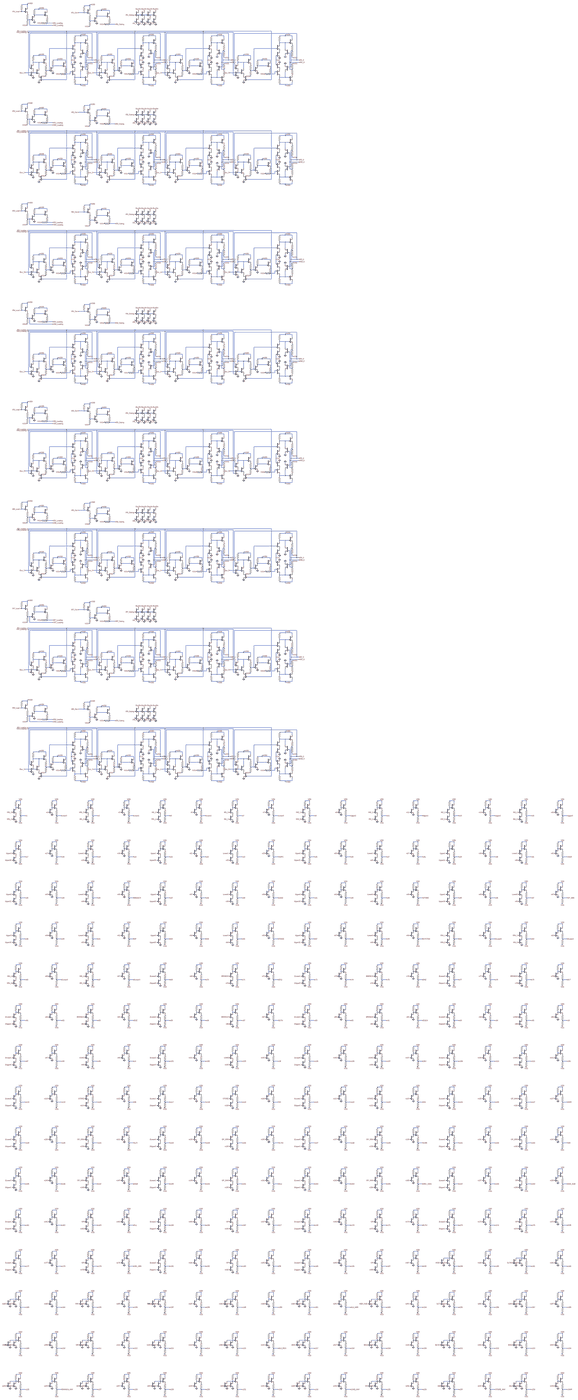
[diagram p0: schematic rv32i_instruction_register.asc, whole sheet]
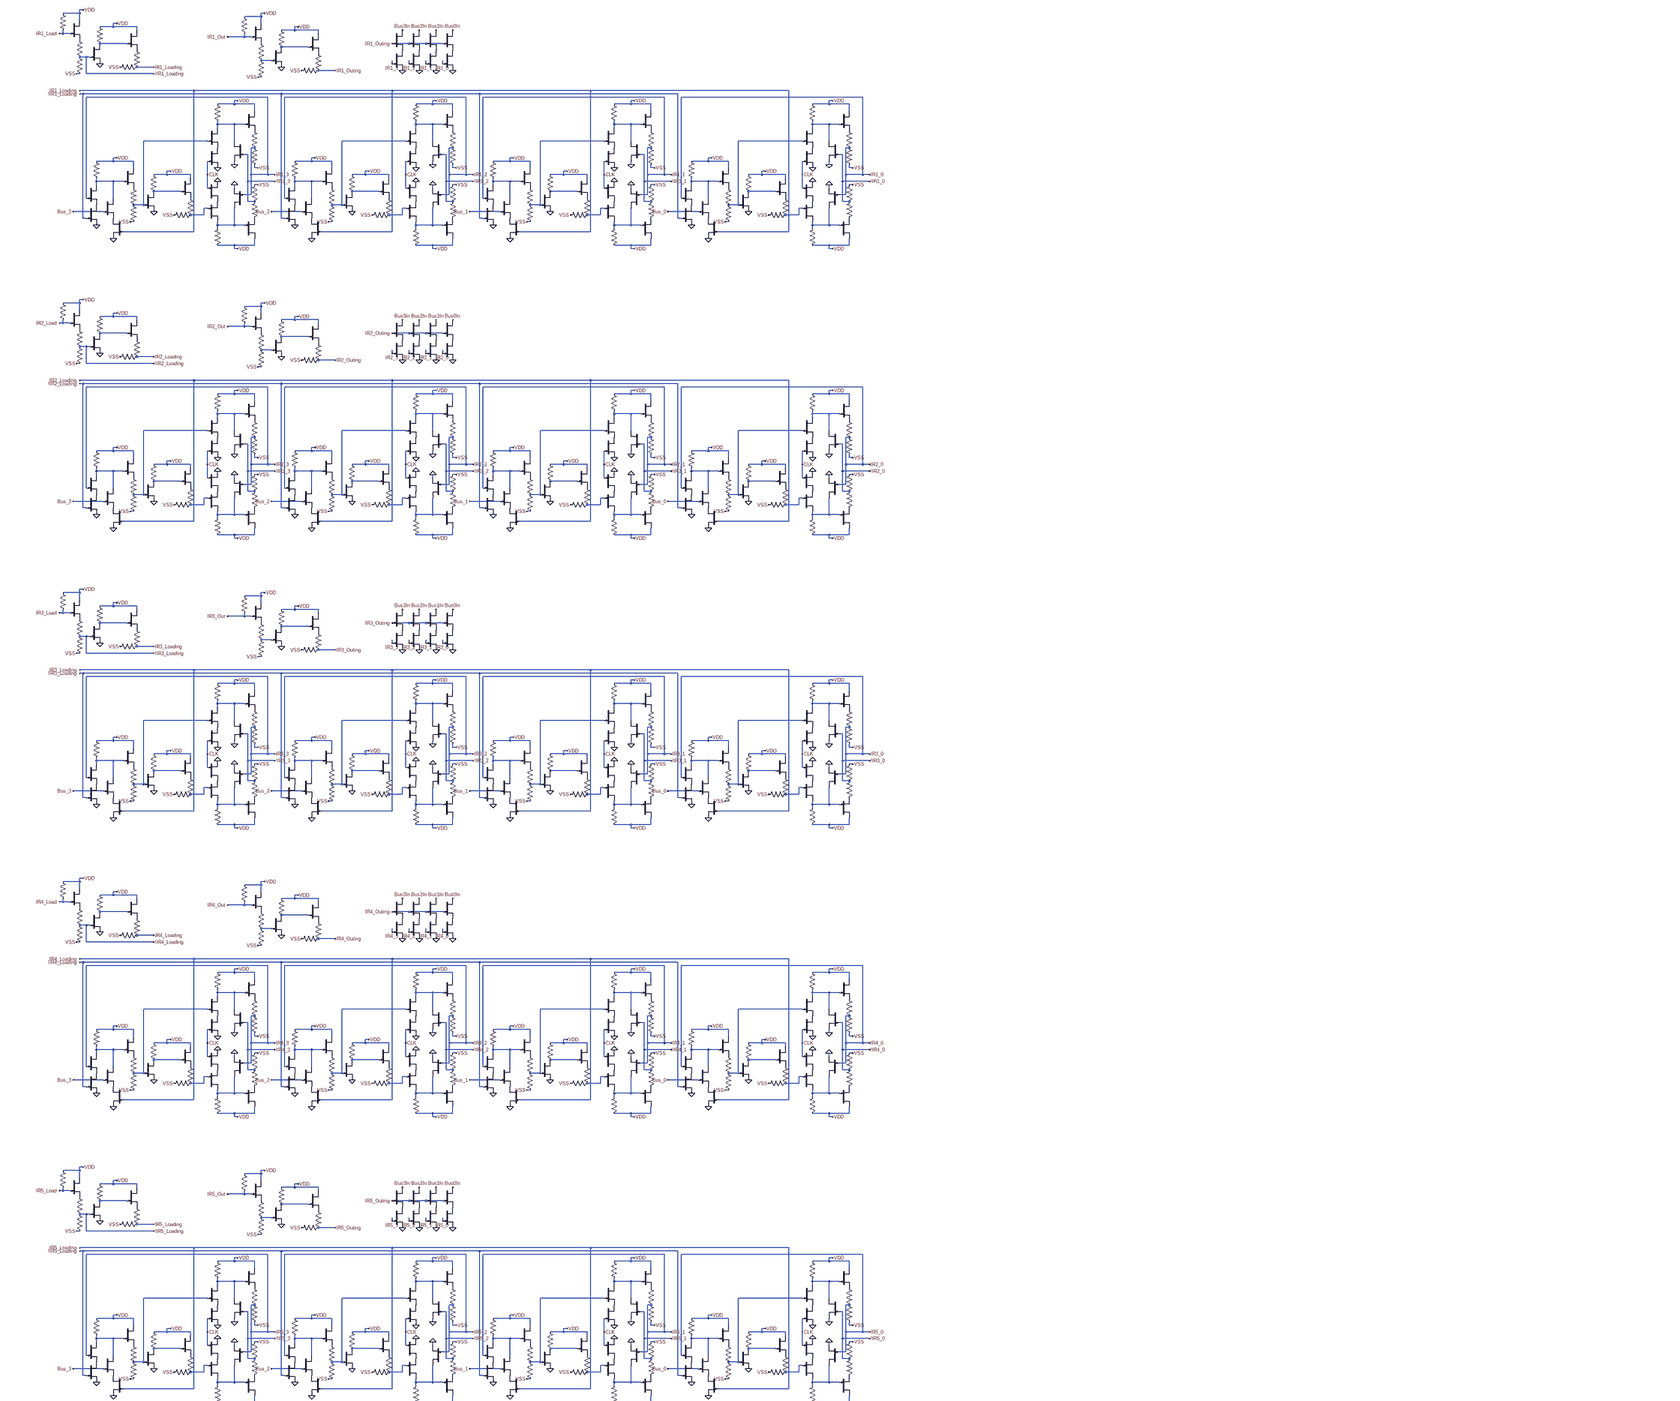
[diagram p1: schematic rv32i_instruction_register.asc, part, row 1 of 3, column 1 of 1]
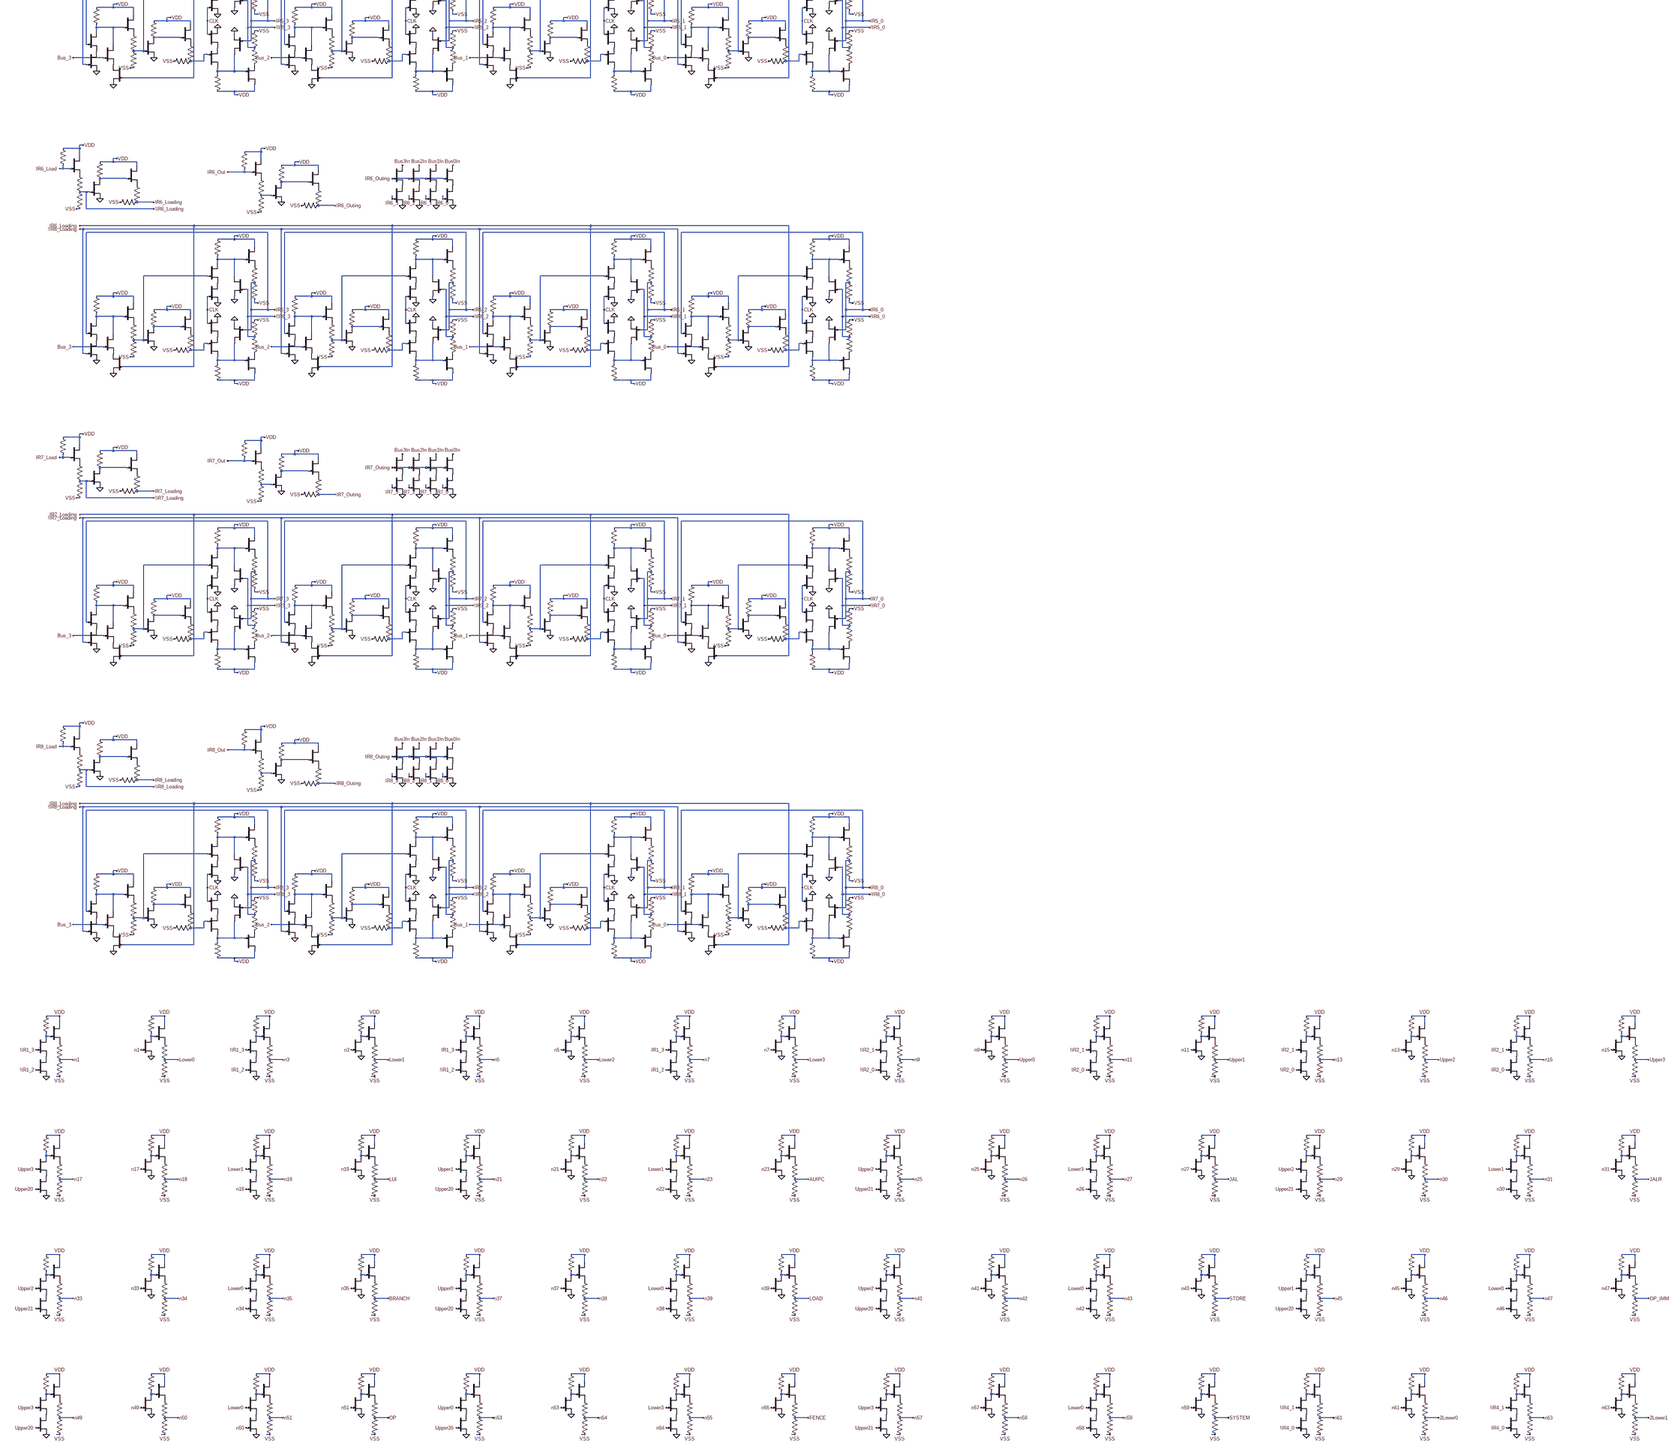
[diagram p2: schematic rv32i_instruction_register.asc, part, row 2 of 3, column 1 of 1]
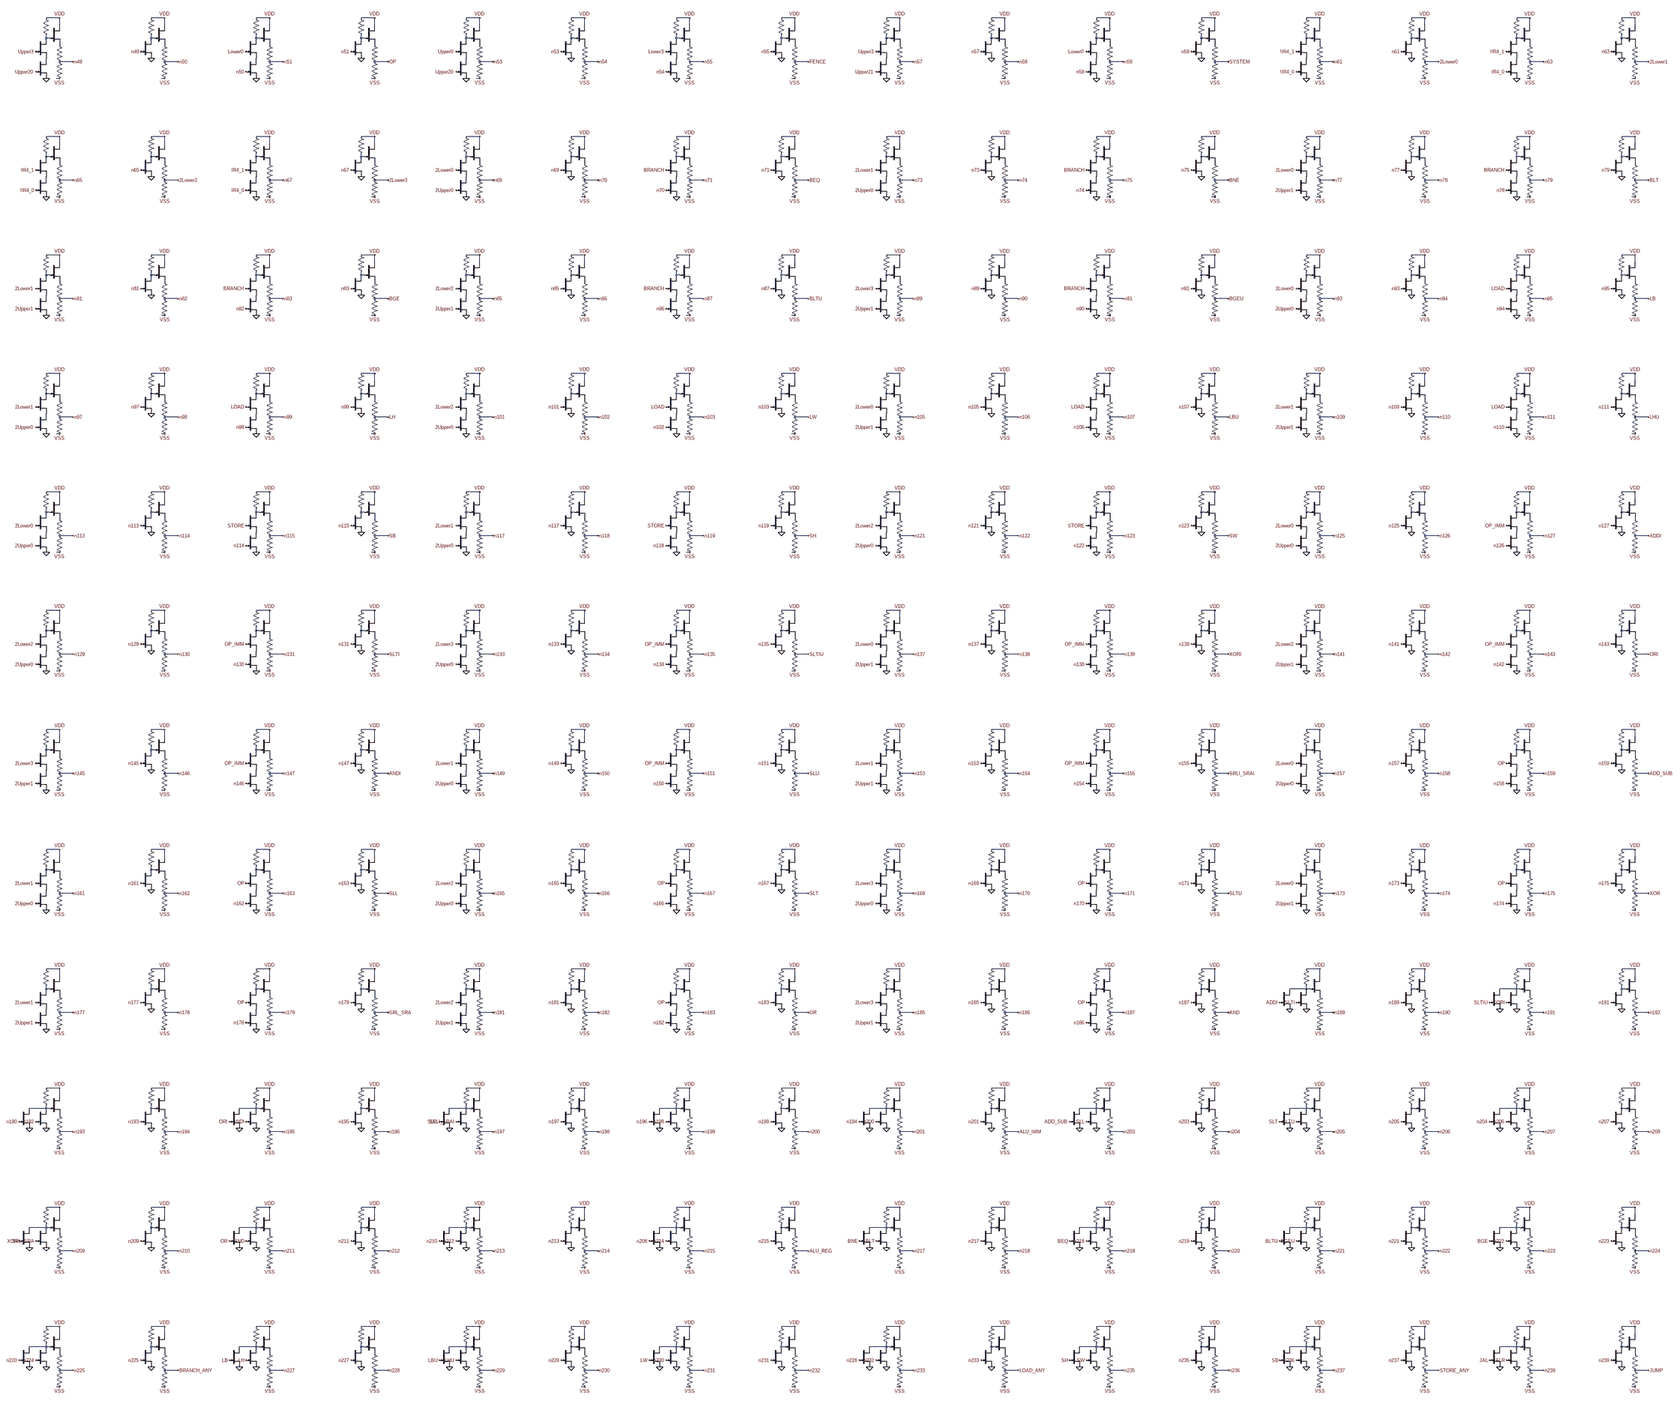
[diagram p3: schematic rv32i_instruction_register.asc, part, row 3 of 3, column 1 of 1]
* rv32i_instruction_register.asc
R1 VDD IR1_Load 100k
J_F1 VDD IR1_Load P001 DR
R2 P001 !IR1_Loading 1k
R3 !IR1_Loading VSS 4.8k
J_A1 N001 !IR1_Loading 0 DR
R4 VDD N001 50k
J_A2 VDD N001 P002 DR
R5 P002 IR1_Loading 1k
R6 IR1_Loading VSS 4.5k
R7 VDD IR1_Out 100k
J_F2 VDD IR1_Out P003 DR
R8 P003 N003 1k
R9 N003 VSS 4.8k
J_A3 N002 N003 0 DR
R10 VDD N002 50k
J_A4 VDD N002 P004 DR
R11 P004 IR1_Outing 1k
R12 IR1_Outing VSS 4.5k
J_A5 N004 N005 P005 DR
R13 VDD N004 100k
J_F3 VDD N004 P006 DR
R14 P006 IR1_3 1k
R15 IR1_3 VSS 4.8k
J_B1 N004 !IR1_3 0 DR
J_A6 N009 N008 P007 DR
R16 VDD N009 100k
J_F4 VDD N009 P008 DR
R17 P008 !IR1_3 1k
R18 !IR1_3 VSS 4.8k
J_B2 N009 IR1_3 0 DR
J_A7 P005 CLK 0 DR
J_A8 P007 CLK 0 DR
J_A9 N006 IR1_3 P009 DR
R19 VDD N006 100k
J_F5 VDD N006 P010 DR
R20 P010 N005 1k
R21 N005 VSS 4.8k
J_B3 N006 Bus_3 P011 DR
J_A10 N007 N005 0 DR
R22 VDD N007 50k
J_A11 VDD N007 P012 DR
R23 P012 N008 1k
R24 N008 VSS 4.5k
J_A12 P009 !IR1_Loading 0 DR
J_B4 P011 IR1_Loading 0 DR
J_A13 N010 N011 P013 DR
R25 VDD N010 100k
J_F6 VDD N010 P014 DR
R26 P014 IR1_2 1k
R27 IR1_2 VSS 4.8k
J_B5 N010 !IR1_2 0 DR
J_A14 N015 N014 P015 DR
R28 VDD N015 100k
J_F7 VDD N015 P016 DR
R29 P016 !IR1_2 1k
R30 !IR1_2 VSS 4.8k
J_B6 N015 IR1_2 0 DR
J_A15 P013 CLK 0 DR
J_A16 P015 CLK 0 DR
J_A17 N012 IR1_2 P017 DR
R31 VDD N012 100k
J_F8 VDD N012 P018 DR
R32 P018 N011 1k
R33 N011 VSS 4.8k
J_B7 N012 Bus_2 P019 DR
J_A18 N013 N011 0 DR
R34 VDD N013 50k
J_A19 VDD N013 P020 DR
R35 P020 N014 1k
R36 N014 VSS 4.5k
J_A20 P017 !IR1_Loading 0 DR
J_B8 P019 IR1_Loading 0 DR
J_A21 N016 N017 P021 DR
R37 VDD N016 100k
J_F9 VDD N016 P022 DR
R38 P022 IR1_1 1k
R39 IR1_1 VSS 4.8k
J_B9 N016 !IR1_1 0 DR
J_A22 N021 N020 P023 DR
R40 VDD N021 100k
J_F10 VDD N021 P024 DR
R41 P024 !IR1_1 1k
R42 !IR1_1 VSS 4.8k
J_B10 N021 IR1_1 0 DR
J_A23 P021 CLK 0 DR
J_A24 P023 CLK 0 DR
J_A25 N018 IR1_1 P025 DR
R43 VDD N018 100k
J_F11 VDD N018 P026 DR
R44 P026 N017 1k
R45 N017 VSS 4.8k
J_B11 N018 Bus_1 P027 DR
J_A26 N019 N017 0 DR
R46 VDD N019 50k
J_A27 VDD N019 P028 DR
R47 P028 N020 1k
R48 N020 VSS 4.5k
J_A28 P025 !IR1_Loading 0 DR
J_B12 P027 IR1_Loading 0 DR
J_A29 N022 N023 P029 DR
R49 VDD N022 100k
J_F12 VDD N022 P030 DR
R50 P030 IR1_0 1k
R51 IR1_0 VSS 4.8k
J_B13 N022 !IR1_0 0 DR
J_A30 N027 N026 P031 DR
R52 VDD N027 100k
J_F13 VDD N027 P032 DR
R53 P032 !IR1_0 1k
R54 !IR1_0 VSS 4.8k
J_B14 N027 IR1_0 0 DR
J_A31 P029 CLK 0 DR
J_A32 P031 CLK 0 DR
J_A33 N024 IR1_0 P033 DR
R55 VDD N024 100k
J_F14 VDD N024 P034 DR
R56 P034 N023 1k
R57 N023 VSS 4.8k
J_B15 N024 Bus_0 P035 DR
J_A34 N025 N023 0 DR
R58 VDD N025 50k
J_A35 VDD N025 P036 DR
R59 P036 N026 1k
R60 N026 VSS 4.5k
J_A36 P033 !IR1_Loading 0 DR
J_B16 P035 IR1_Loading 0 DR
J_BUS1 P037 IR1_3 0 DR
J_BUS2 Bus3In IR1_Outing P037 DR
J_BUS3 P038 IR1_2 0 DR
J_BUS4 Bus2In IR1_Outing P038 DR
J_BUS5 P039 IR1_1 0 DR
J_BUS6 Bus1In IR1_Outing P039 DR
J_BUS7 P040 IR1_0 0 DR
J_BUS8 Bus0In IR1_Outing P040 DR
R61 VDD IR2_Load 100k
J_F15 VDD IR2_Load P041 DR
R62 P041 !IR2_Loading 1k
R63 !IR2_Loading VSS 4.8k
J_A37 N028 !IR2_Loading 0 DR
R64 VDD N028 50k
J_A38 VDD N028 P042 DR
R65 P042 IR2_Loading 1k
R66 IR2_Loading VSS 4.5k
R67 VDD IR2_Out 100k
J_F16 VDD IR2_Out P043 DR
R68 P043 N030 1k
R69 N030 VSS 4.8k
J_A39 N029 N030 0 DR
R70 VDD N029 50k
J_A40 VDD N029 P044 DR
R71 P044 IR2_Outing 1k
R72 IR2_Outing VSS 4.5k
J_A41 N031 N032 P045 DR
R73 VDD N031 100k
J_F17 VDD N031 P046 DR
R74 P046 IR2_3 1k
R75 IR2_3 VSS 4.8k
J_B17 N031 !IR2_3 0 DR
J_A42 N036 N035 P047 DR
R76 VDD N036 100k
J_F18 VDD N036 P048 DR
R77 P048 !IR2_3 1k
R78 !IR2_3 VSS 4.8k
J_B18 N036 IR2_3 0 DR
J_A43 P045 CLK 0 DR
J_A44 P047 CLK 0 DR
J_A45 N033 IR2_3 P049 DR
R79 VDD N033 100k
J_F19 VDD N033 P050 DR
R80 P050 N032 1k
R81 N032 VSS 4.8k
J_B19 N033 Bus_3 P051 DR
J_A46 N034 N032 0 DR
R82 VDD N034 50k
J_A47 VDD N034 P052 DR
R83 P052 N035 1k
R84 N035 VSS 4.5k
J_A48 P049 !IR2_Loading 0 DR
J_B20 P051 IR2_Loading 0 DR
J_A49 N037 N038 P053 DR
R85 VDD N037 100k
J_F20 VDD N037 P054 DR
R86 P054 IR2_2 1k
R87 IR2_2 VSS 4.8k
J_B21 N037 !IR2_2 0 DR
J_A50 N042 N041 P055 DR
R88 VDD N042 100k
J_F21 VDD N042 P056 DR
R89 P056 !IR2_2 1k
R90 !IR2_2 VSS 4.8k
J_B22 N042 IR2_2 0 DR
J_A51 P053 CLK 0 DR
J_A52 P055 CLK 0 DR
J_A53 N039 IR2_2 P057 DR
R91 VDD N039 100k
J_F22 VDD N039 P058 DR
R92 P058 N038 1k
R93 N038 VSS 4.8k
J_B23 N039 Bus_2 P059 DR
J_A54 N040 N038 0 DR
R94 VDD N040 50k
J_A55 VDD N040 P060 DR
R95 P060 N041 1k
R96 N041 VSS 4.5k
J_A56 P057 !IR2_Loading 0 DR
J_B24 P059 IR2_Loading 0 DR
J_A57 N043 N044 P061 DR
R97 VDD N043 100k
J_F23 VDD N043 P062 DR
R98 P062 IR2_1 1k
R99 IR2_1 VSS 4.8k
J_B25 N043 !IR2_1 0 DR
J_A58 N048 N047 P063 DR
R100 VDD N048 100k
J_F24 VDD N048 P064 DR
R101 P064 !IR2_1 1k
R102 !IR2_1 VSS 4.8k
J_B26 N048 IR2_1 0 DR
J_A59 P061 CLK 0 DR
J_A60 P063 CLK 0 DR
J_A61 N045 IR2_1 P065 DR
R103 VDD N045 100k
J_F25 VDD N045 P066 DR
R104 P066 N044 1k
R105 N044 VSS 4.8k
J_B27 N045 Bus_1 P067 DR
J_A62 N046 N044 0 DR
R106 VDD N046 50k
J_A63 VDD N046 P068 DR
R107 P068 N047 1k
R108 N047 VSS 4.5k
J_A64 P065 !IR2_Loading 0 DR
J_B28 P067 IR2_Loading 0 DR
J_A65 N049 N050 P069 DR
R109 VDD N049 100k
J_F26 VDD N049 P070 DR
R110 P070 IR2_0 1k
R111 IR2_0 VSS 4.8k
J_B29 N049 !IR2_0 0 DR
J_A66 N054 N053 P071 DR
R112 VDD N054 100k
J_F27 VDD N054 P072 DR
R113 P072 !IR2_0 1k
R114 !IR2_0 VSS 4.8k
J_B30 N054 IR2_0 0 DR
J_A67 P069 CLK 0 DR
J_A68 P071 CLK 0 DR
J_A69 N051 IR2_0 P073 DR
R115 VDD N051 100k
J_F28 VDD N051 P074 DR
R116 P074 N050 1k
R117 N050 VSS 4.8k
J_B31 N051 Bus_0 P075 DR
J_A70 N052 N050 0 DR
R118 VDD N052 50k
J_A71 VDD N052 P076 DR
R119 P076 N053 1k
R120 N053 VSS 4.5k
J_A72 P073 !IR2_Loading 0 DR
J_B32 P075 IR2_Loading 0 DR
J_BUS9 P077 IR2_3 0 DR
J_BUS10 Bus3In IR2_Outing P077 DR
J_BUS11 P078 IR2_2 0 DR
J_BUS12 Bus2In IR2_Outing P078 DR
J_BUS13 P079 IR2_1 0 DR
J_BUS14 Bus1In IR2_Outing P079 DR
J_BUS15 P080 IR2_0 0 DR
J_BUS16 Bus0In IR2_Outing P080 DR
R121 VDD IR3_Load 100k
J_F29 VDD IR3_Load P081 DR
R122 P081 !IR3_Loading 1k
R123 !IR3_Loading VSS 4.8k
J_A73 N055 !IR3_Loading 0 DR
R124 VDD N055 50k
J_A74 VDD N055 P082 DR
R125 P082 IR3_Loading 1k
R126 IR3_Loading VSS 4.5k
R127 VDD IR3_Out 100k
J_F30 VDD IR3_Out P083 DR
R128 P083 N057 1k
R129 N057 VSS 4.8k
J_A75 N056 N057 0 DR
R130 VDD N056 50k
J_A76 VDD N056 P084 DR
R131 P084 IR3_Outing 1k
R132 IR3_Outing VSS 4.5k
J_A77 N058 N059 P085 DR
R133 VDD N058 100k
J_F31 VDD N058 P086 DR
R134 P086 IR3_3 1k
R135 IR3_3 VSS 4.8k
J_B33 N058 !IR3_3 0 DR
J_A78 N063 N062 P087 DR
R136 VDD N063 100k
J_F32 VDD N063 P088 DR
R137 P088 !IR3_3 1k
R138 !IR3_3 VSS 4.8k
J_B34 N063 IR3_3 0 DR
J_A79 P085 CLK 0 DR
J_A80 P087 CLK 0 DR
J_A81 N060 IR3_3 P089 DR
R139 VDD N060 100k
J_F33 VDD N060 P090 DR
R140 P090 N059 1k
R141 N059 VSS 4.8k
J_B35 N060 Bus_3 P091 DR
J_A82 N061 N059 0 DR
R142 VDD N061 50k
J_A83 VDD N061 P092 DR
R143 P092 N062 1k
R144 N062 VSS 4.5k
J_A84 P089 !IR3_Loading 0 DR
J_B36 P091 IR3_Loading 0 DR
J_A85 N064 N065 P093 DR
R145 VDD N064 100k
J_F34 VDD N064 P094 DR
R146 P094 IR3_2 1k
R147 IR3_2 VSS 4.8k
J_B37 N064 !IR3_2 0 DR
J_A86 N069 N068 P095 DR
R148 VDD N069 100k
J_F35 VDD N069 P096 DR
R149 P096 !IR3_2 1k
R150 !IR3_2 VSS 4.8k
J_B38 N069 IR3_2 0 DR
J_A87 P093 CLK 0 DR
J_A88 P095 CLK 0 DR
J_A89 N066 IR3_2 P097 DR
R151 VDD N066 100k
J_F36 VDD N066 P098 DR
R152 P098 N065 1k
R153 N065 VSS 4.8k
J_B39 N066 Bus_2 P099 DR
J_A90 N067 N065 0 DR
R154 VDD N067 50k
J_A91 VDD N067 P100 DR
R155 P100 N068 1k
R156 N068 VSS 4.5k
J_A92 P097 !IR3_Loading 0 DR
J_B40 P099 IR3_Loading 0 DR
J_A93 N070 N071 P101 DR
R157 VDD N070 100k
J_F37 VDD N070 P102 DR
R158 P102 IR3_1 1k
R159 IR3_1 VSS 4.8k
J_B41 N070 !IR3_1 0 DR
J_A94 N075 N074 P103 DR
R160 VDD N075 100k
J_F38 VDD N075 P104 DR
R161 P104 !IR3_1 1k
R162 !IR3_1 VSS 4.8k
J_B42 N075 IR3_1 0 DR
J_A95 P101 CLK 0 DR
J_A96 P103 CLK 0 DR
J_A97 N072 IR3_1 P105 DR
R163 VDD N072 100k
J_F39 VDD N072 P106 DR
R164 P106 N071 1k
R165 N071 VSS 4.8k
J_B43 N072 Bus_1 P107 DR
J_A98 N073 N071 0 DR
R166 VDD N073 50k
J_A99 VDD N073 P108 DR
R167 P108 N074 1k
R168 N074 VSS 4.5k
J_A100 P105 !IR3_Loading 0 DR
J_B44 P107 IR3_Loading 0 DR
J_A101 N076 N077 P109 DR
R169 VDD N076 100k
J_F40 VDD N076 P110 DR
R170 P110 IR3_0 1k
R171 IR3_0 VSS 4.8k
J_B45 N076 !IR3_0 0 DR
J_A102 N081 N080 P111 DR
R172 VDD N081 100k
J_F41 VDD N081 P112 DR
R173 P112 !IR3_0 1k
R174 !IR3_0 VSS 4.8k
J_B46 N081 IR3_0 0 DR
J_A103 P109 CLK 0 DR
J_A104 P111 CLK 0 DR
J_A105 N078 IR3_0 P113 DR
R175 VDD N078 100k
J_F42 VDD N078 P114 DR
R176 P114 N077 1k
R177 N077 VSS 4.8k
J_B47 N078 Bus_0 P115 DR
J_A106 N079 N077 0 DR
R178 VDD N079 50k
J_A107 VDD N079 P116 DR
R179 P116 N080 1k
R180 N080 VSS 4.5k
J_A108 P113 !IR3_Loading 0 DR
J_B48 P115 IR3_Loading 0 DR
J_BUS17 P117 IR3_3 0 DR
J_BUS18 Bus3In IR3_Outing P117 DR
J_BUS19 P118 IR3_2 0 DR
J_BUS20 Bus2In IR3_Outing P118 DR
J_BUS21 P119 IR3_1 0 DR
J_BUS22 Bus1In IR3_Outing P119 DR
J_BUS23 P120 IR3_0 0 DR
J_BUS24 Bus0In IR3_Outing P120 DR
R181 VDD IR4_Load 100k
J_F43 VDD IR4_Load P121 DR
R182 P121 !IR4_Loading 1k
R183 !IR4_Loading VSS 4.8k
J_A109 N082 !IR4_Loading 0 DR
R184 VDD N082 50k
J_A110 VDD N082 P122 DR
R185 P122 IR4_Loading 1k
R186 IR4_Loading VSS 4.5k
R187 VDD IR4_Out 100k
J_F44 VDD IR4_Out P123 DR
R188 P123 N084 1k
R189 N084 VSS 4.8k
J_A111 N083 N084 0 DR
R190 VDD N083 50k
J_A112 VDD N083 P124 DR
R191 P124 IR4_Outing 1k
R192 IR4_Outing VSS 4.5k
J_A113 N085 N086 P125 DR
R193 VDD N085 100k
J_F45 VDD N085 P126 DR
R194 P126 IR4_3 1k
R195 IR4_3 VSS 4.8k
J_B49 N085 !IR4_3 0 DR
J_A114 N090 N089 P127 DR
R196 VDD N090 100k
J_F46 VDD N090 P128 DR
R197 P128 !IR4_3 1k
R198 !IR4_3 VSS 4.8k
J_B50 N090 IR4_3 0 DR
J_A115 P125 CLK 0 DR
J_A116 P127 CLK 0 DR
J_A117 N087 IR4_3 P129 DR
R199 VDD N087 100k
J_F47 VDD N087 P130 DR
R200 P130 N086 1k
R201 N086 VSS 4.8k
J_B51 N087 Bus_3 P131 DR
J_A118 N088 N086 0 DR
R202 VDD N088 50k
J_A119 VDD N088 P132 DR
R203 P132 N089 1k
R204 N089 VSS 4.5k
J_A120 P129 !IR4_Loading 0 DR
J_B52 P131 IR4_Loading 0 DR
J_A121 N091 N092 P133 DR
R205 VDD N091 100k
J_F48 VDD N091 P134 DR
R206 P134 IR4_2 1k
R207 IR4_2 VSS 4.8k
J_B53 N091 !IR4_2 0 DR
J_A122 N096 N095 P135 DR
R208 VDD N096 100k
J_F49 VDD N096 P136 DR
R209 P136 !IR4_2 1k
R210 !IR4_2 VSS 4.8k
J_B54 N096 IR4_2 0 DR
J_A123 P133 CLK 0 DR
J_A124 P135 CLK 0 DR
J_A125 N093 IR4_2 P137 DR
R211 VDD N093 100k
J_F50 VDD N093 P138 DR
R212 P138 N092 1k
R213 N092 VSS 4.8k
J_B55 N093 Bus_2 P139 DR
J_A126 N094 N092 0 DR
R214 VDD N094 50k
J_A127 VDD N094 P140 DR
R215 P140 N095 1k
R216 N095 VSS 4.5k
J_A128 P137 !IR4_Loading 0 DR
J_B56 P139 IR4_Loading 0 DR
J_A129 N097 N098 P141 DR
R217 VDD N097 100k
J_F51 VDD N097 P142 DR
R218 P142 IR4_1 1k
R219 IR4_1 VSS 4.8k
J_B57 N097 !IR4_1 0 DR
J_A130 N108 N104 P143 DR
R220 VDD N108 100k
J_F52 VDD N108 P144 DR
R221 P144 !IR4_1 1k
R222 !IR4_1 VSS 4.8k
J_B58 N108 IR4_1 0 DR
J_A131 P141 CLK 0 DR
J_A132 P143 CLK 0 DR
J_A133 N099 IR4_1 P145 DR
R223 VDD N099 100k
J_F53 VDD N099 P146 DR
R224 P146 N098 1k
R225 N098 VSS 4.8k
J_B59 N099 Bus_1 P147 DR
J_A134 N100 N098 0 DR
R226 VDD N100 50k
J_A135 VDD N100 P148 DR
R227 P148 N104 1k
R228 N104 VSS 4.5k
J_A136 P145 !IR4_Loading 0 DR
J_B60 P147 IR4_Loading 0 DR
J_A137 N112 N116 P149 DR
R229 VDD N112 100k
J_F54 VDD N112 P150 DR
R230 P150 IR4_0 1k
R231 IR4_0 VSS 4.8k
J_B61 N112 !IR4_0 0 DR
J_A138 N132 N128 P151 DR
R232 VDD N132 100k
J_F55 VDD N132 P152 DR
R233 P152 !IR4_0 1k
R234 !IR4_0 VSS 4.8k
J_B62 N132 IR4_0 0 DR
J_A139 P149 CLK 0 DR
J_A140 P151 CLK 0 DR
J_A141 N120 IR4_0 P153 DR
R235 VDD N120 100k
J_F56 VDD N120 P154 DR
R236 P154 N116 1k
R237 N116 VSS 4.8k
J_B63 N120 Bus_0 P155 DR
J_A142 N124 N116 0 DR
R238 VDD N124 50k
J_A143 VDD N124 P156 DR
R239 P156 N128 1k
R240 N128 VSS 4.5k
J_A144 P153 !IR4_Loading 0 DR
J_B64 P155 IR4_Loading 0 DR
J_BUS25 P157 IR4_3 0 DR
J_BUS26 Bus3In IR4_Outing P157 DR
J_BUS27 P158 IR4_2 0 DR
J_BUS28 Bus2In IR4_Outing P158 DR
J_BUS29 P159 IR4_1 0 DR
J_BUS30 Bus1In IR4_Outing P159 DR
J_BUS31 P160 IR4_0 0 DR
J_BUS32 Bus0In IR4_Outing P160 DR
R241 VDD IR5_Load 100k
J_F57 VDD IR5_Load P161 DR
R242 P161 !IR5_Loading 1k
R243 !IR5_Loading VSS 4.8k
J_A145 N136 !IR5_Loading 0 DR
R244 VDD N136 50k
J_A146 VDD N136 P162 DR
R245 P162 IR5_Loading 1k
R246 IR5_Loading VSS 4.5k
R247 VDD IR5_Out 100k
J_F58 VDD IR5_Out P163 DR
R248 P163 N144 1k
R249 N144 VSS 4.8k
J_A147 N140 N144 0 DR
R250 VDD N140 50k
J_A148 VDD N140 P164 DR
R251 P164 IR5_Outing 1k
R252 IR5_Outing VSS 4.5k
J_A149 N148 N152 P165 DR
R253 VDD N148 100k
J_F59 VDD N148 P166 DR
R254 P166 IR5_3 1k
R255 IR5_3 VSS 4.8k
J_B65 N148 !IR5_3 0 DR
J_A150 N168 N164 P167 DR
R256 VDD N168 100k
J_F60 VDD N168 P168 DR
R257 P168 !IR5_3 1k
R258 !IR5_3 VSS 4.8k
J_B66 N168 IR5_3 0 DR
J_A151 P165 CLK 0 DR
J_A152 P167 CLK 0 DR
J_A153 N156 IR5_3 P169 DR
R259 VDD N156 100k
J_F61 VDD N156 P170 DR
R260 P170 N152 1k
R261 N152 VSS 4.8k
J_B67 N156 Bus_3 P171 DR
J_A154 N160 N152 0 DR
R262 VDD N160 50k
J_A155 VDD N160 P172 DR
R263 P172 N164 1k
R264 N164 VSS 4.5k
J_A156 P169 !IR5_Loading 0 DR
J_B68 P171 IR5_Loading 0 DR
J_A157 N172 N176 P173 DR
R265 VDD N172 100k
J_F62 VDD N172 P174 DR
R266 P174 IR5_2 1k
R267 IR5_2 VSS 4.8k
J_B69 N172 !IR5_2 0 DR
J_A158 N202 N188 P175 DR
R268 VDD N202 100k
J_F63 VDD N202 P176 DR
R269 P176 !IR5_2 1k
R270 !IR5_2 VSS 4.8k
J_B70 N202 IR5_2 0 DR
J_A159 P173 CLK 0 DR
J_A160 P175 CLK 0 DR
J_A161 N180 IR5_2 P177 DR
R271 VDD N180 100k
J_F64 VDD N180 P178 DR
R272 P178 N176 1k
R273 N176 VSS 4.8k
J_B71 N180 Bus_2 P179 DR
J_A162 N184 N176 0 DR
R274 VDD N184 50k
J_A163 VDD N184 P180 DR
R275 P180 N188 1k
R276 N188 VSS 4.5k
J_A164 P177 !IR5_Loading 0 DR
J_B72 P179 IR5_Loading 0 DR
J_A165 N216 N226 P181 DR
R277 VDD N216 100k
J_F65 VDD N216 P182 DR
R278 P182 IR5_1 1k
R279 IR5_1 VSS 4.8k
J_B73 N216 !IR5_1 0 DR
J_A166 N241 N240 P183 DR
R280 VDD N241 100k
J_F66 VDD N241 P184 DR
R281 P184 !IR5_1 1k
R282 !IR5_1 VSS 4.8k
J_B74 N241 IR5_1 0 DR
J_A167 P181 CLK 0 DR
J_A168 P183 CLK 0 DR
J_A169 N234 IR5_1 P185 DR
R283 VDD N234 100k
J_F67 VDD N234 P186 DR
R284 P186 N226 1k
R285 N226 VSS 4.8k
J_B75 N234 Bus_1 P187 DR
J_A170 N238 N226 0 DR
R286 VDD N238 50k
J_A171 VDD N238 P188 DR
R287 P188 N240 1k
R288 N240 VSS 4.5k
J_A172 P185 !IR5_Loading 0 DR
J_B76 P187 IR5_Loading 0 DR
J_A173 N242 N243 P189 DR
R289 VDD N242 100k
J_F68 VDD N242 P190 DR
R290 P190 IR5_0 1k
R291 IR5_0 VSS 4.8k
J_B77 N242 !IR5_0 0 DR
J_A174 N247 N246 P191 DR
R292 VDD N247 100k
J_F69 VDD N247 P192 DR
R293 P192 !IR5_0 1k
R294 !IR5_0 VSS 4.8k
J_B78 N247 IR5_0 0 DR
J_A175 P189 CLK 0 DR
J_A176 P191 CLK 0 DR
J_A177 N244 IR5_0 P193 DR
R295 VDD N244 100k
J_F70 VDD N244 P194 DR
R296 P194 N243 1k
R297 N243 VSS 4.8k
J_B79 N244 Bus_0 P195 DR
J_A178 N245 N243 0 DR
R298 VDD N245 50k
J_A179 VDD N245 P196 DR
R299 P196 N246 1k
R300 N246 VSS 4.5k
J_A180 P193 !IR5_Loading 0 DR
J_B80 P195 IR5_Loading 0 DR
J_BUS33 P197 IR5_3 0 DR
J_BUS34 Bus3In IR5_Outing P197 DR
J_BUS35 P198 IR5_2 0 DR
J_BUS36 Bus2In IR5_Outing P198 DR
J_BUS37 P199 IR5_1 0 DR
J_BUS38 Bus1In IR5_Outing P199 DR
J_BUS39 P200 IR5_0 0 DR
J_BUS40 Bus0In IR5_Outing P200 DR
R301 VDD IR6_Load 100k
J_F71 VDD IR6_Load P201 DR
R302 P201 !IR6_Loading 1k
R303 !IR6_Loading VSS 4.8k
J_A181 N248 !IR6_Loading 0 DR
R304 VDD N248 50k
J_A182 VDD N248 P202 DR
R305 P202 IR6_Loading 1k
R306 IR6_Loading VSS 4.5k
R307 VDD IR6_Out 100k
J_F72 VDD IR6_Out P203 DR
R308 P203 N250 1k
R309 N250 VSS 4.8k
J_A183 N249 N250 0 DR
R310 VDD N249 50k
J_A184 VDD N249 P204 DR
R311 P204 IR6_Outing 1k
R312 IR6_Outing VSS 4.5k
J_A185 N251 N252 P205 DR
R313 VDD N251 100k
J_F73 VDD N251 P206 DR
R314 P206 IR6_3 1k
R315 IR6_3 VSS 4.8k
J_B81 N251 !IR6_3 0 DR
J_A186 N256 N255 P207 DR
R316 VDD N256 100k
J_F74 VDD N256 P208 DR
R317 P208 !IR6_3 1k
R318 !IR6_3 VSS 4.8k
J_B82 N256 IR6_3 0 DR
J_A187 P205 CLK 0 DR
J_A188 P207 CLK 0 DR
J_A189 N253 IR6_3 P209 DR
R319 VDD N253 100k
J_F75 VDD N253 P210 DR
R320 P210 N252 1k
R321 N252 VSS 4.8k
J_B83 N253 Bus_3 P211 DR
J_A190 N254 N252 0 DR
R322 VDD N254 50k
J_A191 VDD N254 P212 DR
R323 P212 N255 1k
R324 N255 VSS 4.5k
J_A192 P209 !IR6_Loading 0 DR
J_B84 P211 IR6_Loading 0 DR
J_A193 N257 N258 P213 DR
R325 VDD N257 100k
J_F76 VDD N257 P214 DR
R326 P214 IR6_2 1k
R327 IR6_2 VSS 4.8k
J_B85 N257 !IR6_2 0 DR
J_A194 N262 N261 P215 DR
R328 VDD N262 100k
J_F77 VDD N262 P216 DR
R329 P216 !IR6_2 1k
R330 !IR6_2 VSS 4.8k
J_B86 N262 IR6_2 0 DR
J_A195 P213 CLK 0 DR
J_A196 P215 CLK 0 DR
J_A197 N259 IR6_2 P217 DR
R331 VDD N259 100k
J_F78 VDD N259 P218 DR
R332 P218 N258 1k
R333 N258 VSS 4.8k
J_B87 N259 Bus_2 P219 DR
J_A198 N260 N258 0 DR
R334 VDD N260 50k
J_A199 VDD N260 P220 DR
R335 P220 N261 1k
R336 N261 VSS 4.5k
J_A200 P217 !IR6_Loading 0 DR
J_B88 P219 IR6_Loading 0 DR
J_A201 N263 N264 P221 DR
R337 VDD N263 100k
J_F79 VDD N263 P222 DR
R338 P222 IR6_1 1k
R339 IR6_1 VSS 4.8k
J_B89 N263 !IR6_1 0 DR
J_A202 N268 N267 P223 DR
R340 VDD N268 100k
J_F80 VDD N268 P224 DR
R341 P224 !IR6_1 1k
R342 !IR6_1 VSS 4.8k
J_B90 N268 IR6_1 0 DR
J_A203 P221 CLK 0 DR
J_A204 P223 CLK 0 DR
J_A205 N265 IR6_1 P225 DR
R343 VDD N265 100k
J_F81 VDD N265 P226 DR
R344 P226 N264 1k
R345 N264 VSS 4.8k
J_B91 N265 Bus_1 P227 DR
J_A206 N266 N264 0 DR
R346 VDD N266 50k
J_A207 VDD N266 P228 DR
R347 P228 N267 1k
R348 N267 VSS 4.5k
J_A208 P225 !IR6_Loading 0 DR
J_B92 P227 IR6_Loading 0 DR
J_A209 N269 N270 P229 DR
R349 VDD N269 100k
J_F82 VDD N269 P230 DR
R350 P230 IR6_0 1k
R351 IR6_0 VSS 4.8k
J_B93 N269 !IR6_0 0 DR
J_A210 N274 N273 P231 DR
R352 VDD N274 100k
J_F83 VDD N274 P232 DR
R353 P232 !IR6_0 1k
R354 !IR6_0 VSS 4.8k
J_B94 N274 IR6_0 0 DR
J_A211 P229 CLK 0 DR
J_A212 P231 CLK 0 DR
J_A213 N271 IR6_0 P233 DR
R355 VDD N271 100k
J_F84 VDD N271 P234 DR
R356 P234 N270 1k
R357 N270 VSS 4.8k
J_B95 N271 Bus_0 P235 DR
J_A214 N272 N270 0 DR
R358 VDD N272 50k
J_A215 VDD N272 P236 DR
R359 P236 N273 1k
R360 N273 VSS 4.5k
J_A216 P233 !IR6_Loading 0 DR
J_B96 P235 IR6_Loading 0 DR
J_BUS41 P237 IR6_3 0 DR
J_BUS42 Bus3In IR6_Outing P237 DR
J_BUS43 P238 IR6_2 0 DR
J_BUS44 Bus2In IR6_Outing P238 DR
J_BUS45 P239 IR6_1 0 DR
J_BUS46 Bus1In IR6_Outing P239 DR
J_BUS47 P240 IR6_0 0 DR
J_BUS48 Bus0In IR6_Outing P240 DR
R361 VDD IR7_Load 100k
J_F85 VDD IR7_Load P241 DR
R362 P241 !IR7_Loading 1k
R363 !IR7_Loading VSS 4.8k
J_A217 N275 !IR7_Loading 0 DR
R364 VDD N275 50k
J_A218 VDD N275 P242 DR
R365 P242 IR7_Loading 1k
R366 IR7_Loading VSS 4.5k
R367 VDD IR7_Out 100k
J_F86 VDD IR7_Out P243 DR
R368 P243 N277 1k
R369 N277 VSS 4.8k
J_A219 N276 N277 0 DR
R370 VDD N276 50k
J_A220 VDD N276 P244 DR
R371 P244 IR7_Outing 1k
R372 IR7_Outing VSS 4.5k
J_A221 N278 N279 P245 DR
R373 VDD N278 100k
J_F87 VDD N278 P246 DR
R374 P246 IR7_3 1k
R375 IR7_3 VSS 4.8k
J_B97 N278 !IR7_3 0 DR
J_A222 N283 N282 P247 DR
R376 VDD N283 100k
J_F88 VDD N283 P248 DR
R377 P248 !IR7_3 1k
R378 !IR7_3 VSS 4.8k
J_B98 N283 IR7_3 0 DR
J_A223 P245 CLK 0 DR
J_A224 P247 CLK 0 DR
J_A225 N280 IR7_3 P249 DR
R379 VDD N280 100k
J_F89 VDD N280 P250 DR
R380 P250 N279 1k
R381 N279 VSS 4.8k
J_B99 N280 Bus_3 P251 DR
J_A226 N281 N279 0 DR
R382 VDD N281 50k
J_A227 VDD N281 P252 DR
R383 P252 N282 1k
R384 N282 VSS 4.5k
J_A228 P249 !IR7_Loading 0 DR
J_B100 P251 IR7_Loading 0 DR
J_A229 N284 N285 P253 DR
R385 VDD N284 100k
J_F90 VDD N284 P254 DR
R386 P254 IR7_2 1k
R387 IR7_2 VSS 4.8k
J_B101 N284 !IR7_2 0 DR
J_A230 N289 N288 P255 DR
R388 VDD N289 100k
J_F91 VDD N289 P256 DR
R389 P256 !IR7_2 1k
R390 !IR7_2 VSS 4.8k
J_B102 N289 IR7_2 0 DR
J_A231 P253 CLK 0 DR
J_A232 P255 CLK 0 DR
J_A233 N286 IR7_2 P257 DR
R391 VDD N286 100k
J_F92 VDD N286 P258 DR
R392 P258 N285 1k
R393 N285 VSS 4.8k
J_B103 N286 Bus_2 P259 DR
J_A234 N287 N285 0 DR
R394 VDD N287 50k
J_A235 VDD N287 P260 DR
R395 P260 N288 1k
R396 N288 VSS 4.5k
J_A236 P257 !IR7_Loading 0 DR
J_B104 P259 IR7_Loading 0 DR
J_A237 N290 N291 P261 DR
R397 VDD N290 100k
J_F93 VDD N290 P262 DR
R398 P262 IR7_1 1k
R399 IR7_1 VSS 4.8k
J_B105 N290 !IR7_1 0 DR
J_A238 N295 N294 P263 DR
R400 VDD N295 100k
J_F94 VDD N295 P264 DR
R401 P264 !IR7_1 1k
R402 !IR7_1 VSS 4.8k
J_B106 N295 IR7_1 0 DR
J_A239 P261 CLK 0 DR
J_A240 P263 CLK 0 DR
J_A241 N292 IR7_1 P265 DR
R403 VDD N292 100k
J_F95 VDD N292 P266 DR
R404 P266 N291 1k
R405 N291 VSS 4.8k
J_B107 N292 Bus_1 P267 DR
J_A242 N293 N291 0 DR
R406 VDD N293 50k
J_A243 VDD N293 P268 DR
R407 P268 N294 1k
R408 N294 VSS 4.5k
J_A244 P265 !IR7_Loading 0 DR
J_B108 P267 IR7_Loading 0 DR
J_A245 N296 N297 P269 DR
R409 VDD N296 100k
J_F96 VDD N296 P270 DR
R410 P270 IR7_0 1k
R411 IR7_0 VSS 4.8k
J_B109 N296 !IR7_0 0 DR
J_A246 N301 N300 P271 DR
R412 VDD N301 100k
J_F97 VDD N301 P272 DR
R413 P272 !IR7_0 1k
R414 !IR7_0 VSS 4.8k
J_B110 N301 IR7_0 0 DR
J_A247 P269 CLK 0 DR
J_A248 P271 CLK 0 DR
J_A249 N298 IR7_0 P273 DR
R415 VDD N298 100k
J_F98 VDD N298 P274 DR
R416 P274 N297 1k
R417 N297 VSS 4.8k
J_B111 N298 Bus_0 P275 DR
J_A250 N299 N297 0 DR
R418 VDD N299 50k
J_A251 VDD N299 P276 DR
R419 P276 N300 1k
R420 N300 VSS 4.5k
J_A252 P273 !IR7_Loading 0 DR
J_B112 P275 IR7_Loading 0 DR
J_BUS49 P277 IR7_3 0 DR
J_BUS50 Bus3In IR7_Outing P277 DR
J_BUS51 P278 IR7_2 0 DR
J_BUS52 Bus2In IR7_Outing P278 DR
J_BUS53 P279 IR7_1 0 DR
J_BUS54 Bus1In IR7_Outing P279 DR
J_BUS55 P280 IR7_0 0 DR
J_BUS56 Bus0In IR7_Outing P280 DR
R421 VDD IR8_Load 100k
J_F99 VDD IR8_Load P281 DR
R422 P281 !IR8_Loading 1k
R423 !IR8_Loading VSS 4.8k
J_A253 N302 !IR8_Loading 0 DR
R424 VDD N302 50k
J_A254 VDD N302 P282 DR
R425 P282 IR8_Loading 1k
R426 IR8_Loading VSS 4.5k
R427 VDD IR8_Out 100k
J_F100 VDD IR8_Out P283 DR
R428 P283 N304 1k
R429 N304 VSS 4.8k
J_A255 N303 N304 0 DR
R430 VDD N303 50k
J_A256 VDD N303 P284 DR
R431 P284 IR8_Outing 1k
R432 IR8_Outing VSS 4.5k
J_A257 N305 N306 P285 DR
R433 VDD N305 100k
J_F101 VDD N305 P286 DR
R434 P286 IR8_3 1k
R435 IR8_3 VSS 4.8k
J_B113 N305 !IR8_3 0 DR
J_A258 N310 N309 P287 DR
R436 VDD N310 100k
J_F102 VDD N310 P288 DR
R437 P288 !IR8_3 1k
R438 !IR8_3 VSS 4.8k
J_B114 N310 IR8_3 0 DR
J_A259 P285 CLK 0 DR
J_A260 P287 CLK 0 DR
J_A261 N307 IR8_3 P289 DR
R439 VDD N307 100k
J_F103 VDD N307 P290 DR
R440 P290 N306 1k
R441 N306 VSS 4.8k
J_B115 N307 Bus_3 P291 DR
J_A262 N308 N306 0 DR
R442 VDD N308 50k
J_A263 VDD N308 P292 DR
R443 P292 N309 1k
R444 N309 VSS 4.5k
J_A264 P289 !IR8_Loading 0 DR
J_B116 P291 IR8_Loading 0 DR
J_A265 N311 N312 P293 DR
R445 VDD N311 100k
J_F104 VDD N311 P294 DR
R446 P294 IR8_2 1k
R447 IR8_2 VSS 4.8k
J_B117 N311 !IR8_2 0 DR
J_A266 N316 N315 P295 DR
R448 VDD N316 100k
J_F105 VDD N316 P296 DR
R449 P296 !IR8_2 1k
R450 !IR8_2 VSS 4.8k
J_B118 N316 IR8_2 0 DR
J_A267 P293 CLK 0 DR
J_A268 P295 CLK 0 DR
J_A269 N313 IR8_2 P297 DR
R451 VDD N313 100k
J_F106 VDD N313 P298 DR
R452 P298 N312 1k
R453 N312 VSS 4.8k
J_B119 N313 Bus_2 P299 DR
J_A270 N314 N312 0 DR
R454 VDD N314 50k
J_A271 VDD N314 P300 DR
R455 P300 N315 1k
R456 N315 VSS 4.5k
J_A272 P297 !IR8_Loading 0 DR
J_B120 P299 IR8_Loading 0 DR
J_A273 N317 N318 P301 DR
R457 VDD N317 100k
J_F107 VDD N317 P302 DR
R458 P302 IR8_1 1k
R459 IR8_1 VSS 4.8k
J_B121 N317 !IR8_1 0 DR
J_A274 N322 N321 P303 DR
R460 VDD N322 100k
J_F108 VDD N322 P304 DR
R461 P304 !IR8_1 1k
R462 !IR8_1 VSS 4.8k
J_B122 N322 IR8_1 0 DR
J_A275 P301 CLK 0 DR
J_A276 P303 CLK 0 DR
J_A277 N319 IR8_1 P305 DR
R463 VDD N319 100k
J_F109 VDD N319 P306 DR
R464 P306 N318 1k
R465 N318 VSS 4.8k
J_B123 N319 Bus_1 P307 DR
J_A278 N320 N318 0 DR
R466 VDD N320 50k
J_A279 VDD N320 P308 DR
R467 P308 N321 1k
R468 N321 VSS 4.5k
J_A280 P305 !IR8_Loading 0 DR
J_B124 P307 IR8_Loading 0 DR
J_A281 N323 N324 P309 DR
R469 VDD N323 100k
J_F110 VDD N323 P310 DR
R470 P310 IR8_0 1k
R471 IR8_0 VSS 4.8k
J_B125 N323 !IR8_0 0 DR
J_A282 N328 N327 P311 DR
R472 VDD N328 100k
J_F111 VDD N328 P312 DR
R473 P312 !IR8_0 1k
R474 !IR8_0 VSS 4.8k
J_B126 N328 IR8_0 0 DR
J_A283 P309 CLK 0 DR
J_A284 P311 CLK 0 DR
J_A285 N325 IR8_0 P313 DR
R475 VDD N325 100k
J_F112 VDD N325 P314 DR
R476 P314 N324 1k
R477 N324 VSS 4.8k
J_B127 N325 Bus_0 P315 DR
J_A286 N326 N324 0 DR
R478 VDD N326 50k
J_A287 VDD N326 P316 DR
R479 P316 N327 1k
R480 N327 VSS 4.5k
J_A288 P313 !IR8_Loading 0 DR
J_B128 P315 IR8_Loading 0 DR
J_BUS57 P317 IR8_3 0 DR
J_BUS58 Bus3In IR8_Outing P317 DR
J_BUS59 P318 IR8_2 0 DR
J_BUS60 Bus2In IR8_Outing P318 DR
J_BUS61 P319 IR8_1 0 DR
J_BUS62 Bus1In IR8_Outing P319 DR
J_BUS63 P320 IR8_0 0 DR
J_BUS64 Bus0In IR8_Outing P320 DR
R481 VDD N329 100k
J_F113 VDD N329 P321 DR
R482 P321 n1 1k
R483 n1 VSS 4.8k
J_B129 N329 !IR1_3 P322 DR
J_A289 P322 !IR1_2 0 DR
R484 VDD N330 100k
J_F114 VDD N330 P323 DR
R485 P323 Lower0 1k
R486 Lower0 VSS 4.8k
J_B130 N330 n1 0 DR
R487 VDD N331 100k
J_F115 VDD N331 P324 DR
R488 P324 n3 1k
R489 n3 VSS 4.8k
J_B131 N331 !IR1_3 P325 DR
J_A290 P325 IR1_2 0 DR
R490 VDD N332 100k
J_F116 VDD N332 P326 DR
R491 P326 Lower1 1k
R492 Lower1 VSS 4.8k
J_B132 N332 n3 0 DR
R493 VDD N333 100k
J_F117 VDD N333 P327 DR
R494 P327 n5 1k
R495 n5 VSS 4.8k
J_B133 N333 IR1_3 P328 DR
J_A291 P328 !IR1_2 0 DR
R496 VDD N334 100k
J_F118 VDD N334 P329 DR
R497 P329 Lower2 1k
R498 Lower2 VSS 4.8k
J_B134 N334 n5 0 DR
R499 VDD N335 100k
J_F119 VDD N335 P330 DR
R500 P330 n7 1k
R501 n7 VSS 4.8k
J_B135 N335 IR1_3 P331 DR
J_A292 P331 IR1_2 0 DR
R502 VDD N336 100k
J_F120 VDD N336 P332 DR
R503 P332 Lower3 1k
R504 Lower3 VSS 4.8k
J_B136 N336 n7 0 DR
R505 VDD N337 100k
J_F121 VDD N337 P333 DR
R506 P333 n9 1k
R507 n9 VSS 4.8k
J_B137 N337 !IR2_1 P334 DR
J_A293 P334 !IR2_0 0 DR
R508 VDD N338 100k
J_F122 VDD N338 P335 DR
R509 P335 Upper0 1k
R510 Upper0 VSS 4.8k
J_B138 N338 n9 0 DR
R511 VDD N339 100k
J_F123 VDD N339 P336 DR
R512 P336 n11 1k
R513 n11 VSS 4.8k
J_B139 N339 !IR2_1 P337 DR
J_A294 P337 IR2_0 0 DR
R514 VDD N340 100k
J_F124 VDD N340 P338 DR
R515 P338 Upper1 1k
R516 Upper1 VSS 4.8k
J_B140 N340 n11 0 DR
R517 VDD N341 100k
J_F125 VDD N341 P339 DR
R518 P339 n13 1k
R519 n13 VSS 4.8k
J_B141 N341 IR2_1 P340 DR
J_A295 P340 !IR2_0 0 DR
R520 VDD N342 100k
J_F126 VDD N342 P341 DR
R521 P341 Upper2 1k
R522 Upper2 VSS 4.8k
J_B142 N342 n13 0 DR
R523 VDD N343 100k
J_F127 VDD N343 P342 DR
R524 P342 n15 1k
R525 n15 VSS 4.8k
J_B143 N343 IR2_1 P343 DR
J_A296 P343 IR2_0 0 DR
R526 VDD N344 100k
J_F128 VDD N344 P344 DR
R527 P344 Upper3 1k
R528 Upper3 VSS 4.8k
J_B144 N344 n15 0 DR
R529 VDD N345 100k
J_F129 VDD N345 P345 DR
R530 P345 n17 1k
R531 n17 VSS 4.8k
J_B145 N345 Upper3 P346 DR
J_A297 P346 Upper20 0 DR
R532 VDD N346 100k
J_F130 VDD N346 P347 DR
R533 P347 n18 1k
R534 n18 VSS 4.8k
J_B146 N346 n17 0 DR
R535 VDD N347 100k
J_F131 VDD N347 P348 DR
R536 P348 n19 1k
R537 n19 VSS 4.8k
J_B147 N347 Lower1 P349 DR
J_A298 P349 n18 0 DR
R538 VDD N348 100k
J_F132 VDD N348 P350 DR
R539 P350 LUI 1k
R540 LUI VSS 4.8k
J_B148 N348 n19 0 DR
R541 VDD N349 100k
J_F133 VDD N349 P351 DR
R542 P351 n21 1k
R543 n21 VSS 4.8k
J_B149 N349 Upper1 P352 DR
J_A299 P352 Upper20 0 DR
R544 VDD N350 100k
J_F134 VDD N350 P353 DR
R545 P353 n22 1k
R546 n22 VSS 4.8k
J_B150 N350 n21 0 DR
R547 VDD N351 100k
J_F135 VDD N351 P354 DR
R548 P354 n23 1k
R549 n23 VSS 4.8k
J_B151 N351 Lower1 P355 DR
J_A300 P355 n22 0 DR
R550 VDD N352 100k
J_F136 VDD N352 P356 DR
R551 P356 AUIPC 1k
R552 AUIPC VSS 4.8k
J_B152 N352 n23 0 DR
R553 VDD N353 100k
J_F137 VDD N353 P357 DR
R554 P357 n25 1k
R555 n25 VSS 4.8k
J_B153 N353 Upper2 P358 DR
J_A301 P358 Upper21 0 DR
R556 VDD N354 100k
J_F138 VDD N354 P359 DR
R557 P359 n26 1k
R558 n26 VSS 4.8k
J_B154 N354 n25 0 DR
R559 VDD N355 100k
J_F139 VDD N355 P360 DR
R560 P360 n27 1k
R561 n27 VSS 4.8k
J_B155 N355 Lower3 P361 DR
J_A302 P361 n26 0 DR
R562 VDD N356 100k
J_F140 VDD N356 P362 DR
R563 P362 JAL 1k
R564 JAL VSS 4.8k
J_B156 N356 n27 0 DR
R565 VDD N357 100k
J_F141 VDD N357 P363 DR
R566 P363 n29 1k
R567 n29 VSS 4.8k
J_B157 N357 Upper2 P364 DR
J_A303 P364 Upper21 0 DR
R568 VDD N358 100k
J_F142 VDD N358 P365 DR
R569 P365 n30 1k
R570 n30 VSS 4.8k
J_B158 N358 n29 0 DR
R571 VDD N359 100k
J_F143 VDD N359 P366 DR
R572 P366 n31 1k
R573 n31 VSS 4.8k
J_B159 N359 Lower1 P367 DR
J_A304 P367 n30 0 DR
R574 VDD N360 100k
J_F144 VDD N360 P368 DR
R575 P368 JALR 1k
R576 JALR VSS 4.8k
J_B160 N360 n31 0 DR
R577 VDD N361 100k
J_F145 VDD N361 P369 DR
R578 P369 n33 1k
R579 n33 VSS 4.8k
J_B161 N361 Upper2 P370 DR
J_A305 P370 Upper21 0 DR
R580 VDD N362 100k
J_F146 VDD N362 P371 DR
R581 P371 n34 1k
R582 n34 VSS 4.8k
J_B162 N362 n33 0 DR
R583 VDD N363 100k
J_F147 VDD N363 P372 DR
R584 P372 n35 1k
R585 n35 VSS 4.8k
J_B163 N363 Lower0 P373 DR
J_A306 P373 n34 0 DR
R586 VDD N364 100k
J_F148 VDD N364 P374 DR
R587 P374 BRANCH 1k
R588 BRANCH VSS 4.8k
J_B164 N364 n35 0 DR
R589 VDD N365 100k
J_F149 VDD N365 P375 DR
R590 P375 n37 1k
R591 n37 VSS 4.8k
J_B165 N365 Upper0 P376 DR
J_A307 P376 Upper20 0 DR
R592 VDD N366 100k
J_F150 VDD N366 P377 DR
R593 P377 n38 1k
R594 n38 VSS 4.8k
J_B166 N366 n37 0 DR
R595 VDD N367 100k
J_F151 VDD N367 P378 DR
R596 P378 n39 1k
R597 n39 VSS 4.8k
J_B167 N367 Lower0 P379 DR
J_A308 P379 n38 0 DR
R598 VDD N368 100k
J_F152 VDD N368 P380 DR
R599 P380 LOAD 1k
R600 LOAD VSS 4.8k
J_B168 N368 n39 0 DR
R601 VDD N369 100k
J_F153 VDD N369 P381 DR
R602 P381 n41 1k
R603 n41 VSS 4.8k
J_B169 N369 Upper2 P382 DR
J_A309 P382 Upper20 0 DR
R604 VDD N370 100k
J_F154 VDD N370 P383 DR
R605 P383 n42 1k
R606 n42 VSS 4.8k
J_B170 N370 n41 0 DR
R607 VDD N371 100k
J_F155 VDD N371 P384 DR
R608 P384 n43 1k
R609 n43 VSS 4.8k
J_B171 N371 Lower0 P385 DR
J_A310 P385 n42 0 DR
R610 VDD N372 100k
J_F156 VDD N372 P386 DR
R611 P386 STORE 1k
R612 STORE VSS 4.8k
J_B172 N372 n43 0 DR
R613 VDD N373 100k
J_F157 VDD N373 P387 DR
R614 P387 n45 1k
R615 n45 VSS 4.8k
J_B173 N373 Upper1 P388 DR
J_A311 P388 Upper20 0 DR
R616 VDD N374 100k
J_F158 VDD N374 P389 DR
R617 P389 n46 1k
R618 n46 VSS 4.8k
J_B174 N374 n45 0 DR
R619 VDD N375 100k
J_F159 VDD N375 P390 DR
R620 P390 n47 1k
R621 n47 VSS 4.8k
J_B175 N375 Lower0 P391 DR
J_A312 P391 n46 0 DR
R622 VDD N376 100k
J_F160 VDD N376 P392 DR
R623 P392 OP_IMM 1k
R624 OP_IMM VSS 4.8k
J_B176 N376 n47 0 DR
R625 VDD N377 100k
J_F161 VDD N377 P393 DR
R626 P393 n49 1k
R627 n49 VSS 4.8k
J_B177 N377 Upper3 P394 DR
J_A313 P394 Upper20 0 DR
R628 VDD N378 100k
J_F162 VDD N378 P395 DR
R629 P395 n50 1k
R630 n50 VSS 4.8k
J_B178 N378 n49 0 DR
R631 VDD N379 100k
J_F163 VDD N379 P396 DR
R632 P396 n51 1k
R633 n51 VSS 4.8k
J_B179 N379 Lower0 P397 DR
J_A314 P397 n50 0 DR
R634 VDD N380 100k
J_F164 VDD N380 P398 DR
R635 P398 OP 1k
R636 OP VSS 4.8k
J_B180 N380 n51 0 DR
R637 VDD N381 100k
J_F165 VDD N381 P399 DR
R638 P399 n53 1k
R639 n53 VSS 4.8k
J_B181 N381 Upper0 P400 DR
J_A315 P400 Upper20 0 DR
R640 VDD N382 100k
J_F166 VDD N382 P401 DR
R641 P401 n54 1k
R642 n54 VSS 4.8k
J_B182 N382 n53 0 DR
R643 VDD N383 100k
J_F167 VDD N383 P402 DR
R644 P402 n55 1k
R645 n55 VSS 4.8k
J_B183 N383 Lower3 P403 DR
J_A316 P403 n54 0 DR
R646 VDD N384 100k
J_F168 VDD N384 P404 DR
R647 P404 FENCE 1k
R648 FENCE VSS 4.8k
J_B184 N384 n55 0 DR
R649 VDD N385 100k
J_F169 VDD N385 P405 DR
R650 P405 n57 1k
R651 n57 VSS 4.8k
J_B185 N385 Upper3 P406 DR
J_A317 P406 Upper21 0 DR
R652 VDD N386 100k
J_F170 VDD N386 P407 DR
R653 P407 n58 1k
R654 n58 VSS 4.8k
J_B186 N386 n57 0 DR
R655 VDD N387 100k
J_F171 VDD N387 P408 DR
R656 P408 n59 1k
R657 n59 VSS 4.8k
J_B187 N387 Lower0 P409 DR
J_A318 P409 n58 0 DR
R658 VDD N388 100k
J_F172 VDD N388 P410 DR
R659 P410 SYSTEM 1k
R660 SYSTEM VSS 4.8k
J_B188 N388 n59 0 DR
R661 VDD N389 100k
J_F173 VDD N389 P411 DR
R662 P411 n61 1k
R663 n61 VSS 4.8k
J_B189 N389 !IR4_1 P412 DR
J_A319 P412 !IR4_0 0 DR
R664 VDD N390 100k
J_F174 VDD N390 P413 DR
R665 P413 2Lower0 1k
R666 2Lower0 VSS 4.8k
J_B190 N390 n61 0 DR
R667 VDD N391 100k
J_F175 VDD N391 P414 DR
R668 P414 n63 1k
R669 n63 VSS 4.8k
J_B191 N391 !IR4_1 P415 DR
J_A320 P415 IR4_0 0 DR
R670 VDD N392 100k
J_F176 VDD N392 P416 DR
R671 P416 2Lower1 1k
R672 2Lower1 VSS 4.8k
J_B192 N392 n63 0 DR
R673 VDD N393 100k
J_F177 VDD N393 P417 DR
R674 P417 n65 1k
R675 n65 VSS 4.8k
J_B193 N393 IR4_1 P418 DR
J_A321 P418 !IR4_0 0 DR
R676 VDD N394 100k
J_F178 VDD N394 P419 DR
R677 P419 2Lower2 1k
R678 2Lower2 VSS 4.8k
J_B194 N394 n65 0 DR
R679 VDD N395 100k
J_F179 VDD N395 P420 DR
R680 P420 n67 1k
R681 n67 VSS 4.8k
J_B195 N395 IR4_1 P421 DR
J_A322 P421 IR4_0 0 DR
R682 VDD N396 100k
J_F180 VDD N396 P422 DR
R683 P422 2Lower3 1k
R684 2Lower3 VSS 4.8k
J_B196 N396 n67 0 DR
R685 VDD N397 100k
J_F181 VDD N397 P423 DR
R686 P423 n69 1k
R687 n69 VSS 4.8k
J_B197 N397 2Lower0 P424 DR
J_A323 P424 2Upper0 0 DR
R688 VDD N398 100k
J_F182 VDD N398 P425 DR
R689 P425 n70 1k
R690 n70 VSS 4.8k
J_B198 N398 n69 0 DR
R691 VDD N399 100k
J_F183 VDD N399 P426 DR
R692 P426 n71 1k
R693 n71 VSS 4.8k
J_B199 N399 BRANCH P427 DR
J_A324 P427 n70 0 DR
R694 VDD N400 100k
J_F184 VDD N400 P428 DR
R695 P428 BEQ 1k
R696 BEQ VSS 4.8k
J_B200 N400 n71 0 DR
R697 VDD N401 100k
J_F185 VDD N401 P429 DR
R698 P429 n73 1k
R699 n73 VSS 4.8k
J_B201 N401 2Lower1 P430 DR
J_A325 P430 2Upper0 0 DR
R700 VDD N402 100k
J_F186 VDD N402 P431 DR
R701 P431 n74 1k
R702 n74 VSS 4.8k
J_B202 N402 n73 0 DR
R703 VDD N403 100k
J_F187 VDD N403 P432 DR
R704 P432 n75 1k
R705 n75 VSS 4.8k
J_B203 N403 BRANCH P433 DR
J_A326 P433 n74 0 DR
R706 VDD N404 100k
J_F188 VDD N404 P434 DR
R707 P434 BNE 1k
R708 BNE VSS 4.8k
J_B204 N404 n75 0 DR
R709 VDD N405 100k
J_F189 VDD N405 P435 DR
R710 P435 n77 1k
R711 n77 VSS 4.8k
J_B205 N405 2Lower0 P436 DR
J_A327 P436 2Upper1 0 DR
R712 VDD N406 100k
J_F190 VDD N406 P437 DR
R713 P437 n78 1k
R714 n78 VSS 4.8k
J_B206 N406 n77 0 DR
R715 VDD N407 100k
J_F191 VDD N407 P438 DR
R716 P438 n79 1k
R717 n79 VSS 4.8k
J_B207 N407 BRANCH P439 DR
J_A328 P439 n78 0 DR
R718 VDD N408 100k
J_F192 VDD N408 P440 DR
R719 P440 BLT 1k
R720 BLT VSS 4.8k
J_B208 N408 n79 0 DR
R721 VDD N409 100k
J_F193 VDD N409 P441 DR
R722 P441 n81 1k
R723 n81 VSS 4.8k
J_B209 N409 2Lower1 P442 DR
J_A329 P442 2Upper1 0 DR
R724 VDD N410 100k
J_F194 VDD N410 P443 DR
R725 P443 n82 1k
R726 n82 VSS 4.8k
J_B210 N410 n81 0 DR
R727 VDD N411 100k
J_F195 VDD N411 P444 DR
R728 P444 n83 1k
R729 n83 VSS 4.8k
J_B211 N411 BRANCH P445 DR
J_A330 P445 n82 0 DR
R730 VDD N412 100k
J_F196 VDD N412 P446 DR
R731 P446 BGE 1k
R732 BGE VSS 4.8k
J_B212 N412 n83 0 DR
R733 VDD N413 100k
J_F197 VDD N413 P447 DR
R734 P447 n85 1k
R735 n85 VSS 4.8k
J_B213 N413 2Lower2 P448 DR
J_A331 P448 2Upper1 0 DR
R736 VDD N414 100k
J_F198 VDD N414 P449 DR
R737 P449 n86 1k
R738 n86 VSS 4.8k
J_B214 N414 n85 0 DR
R739 VDD N415 100k
J_F199 VDD N415 P450 DR
R740 P450 n87 1k
R741 n87 VSS 4.8k
J_B215 N415 BRANCH P451 DR
J_A332 P451 n86 0 DR
R742 VDD N416 100k
J_F200 VDD N416 P452 DR
R743 P452 BLTU 1k
R744 BLTU VSS 4.8k
J_B216 N416 n87 0 DR
R745 VDD N417 100k
J_F201 VDD N417 P453 DR
R746 P453 n89 1k
R747 n89 VSS 4.8k
J_B217 N417 2Lower3 P454 DR
J_A333 P454 2Upper1 0 DR
R748 VDD N418 100k
J_F202 VDD N418 P455 DR
R749 P455 n90 1k
R750 n90 VSS 4.8k
J_B218 N418 n89 0 DR
R751 VDD N419 100k
J_F203 VDD N419 P456 DR
R752 P456 n91 1k
R753 n91 VSS 4.8k
J_B219 N419 BRANCH P457 DR
J_A334 P457 n90 0 DR
R754 VDD N420 100k
J_F204 VDD N420 P458 DR
R755 P458 BGEU 1k
R756 BGEU VSS 4.8k
J_B220 N420 n91 0 DR
R757 VDD N421 100k
J_F205 VDD N421 P459 DR
R758 P459 n93 1k
R759 n93 VSS 4.8k
J_B221 N421 2Lower0 P460 DR
J_A335 P460 2Upper0 0 DR
R760 VDD N422 100k
J_F206 VDD N422 P461 DR
R761 P461 n94 1k
R762 n94 VSS 4.8k
J_B222 N422 n93 0 DR
R763 VDD N423 100k
J_F207 VDD N423 P462 DR
R764 P462 n95 1k
R765 n95 VSS 4.8k
J_B223 N423 LOAD P463 DR
J_A336 P463 n94 0 DR
R766 VDD N424 100k
J_F208 VDD N424 P464 DR
R767 P464 LB 1k
R768 LB VSS 4.8k
J_B224 N424 n95 0 DR
R769 VDD N425 100k
J_F209 VDD N425 P465 DR
R770 P465 n97 1k
R771 n97 VSS 4.8k
J_B225 N425 2Lower1 P466 DR
J_A337 P466 2Upper0 0 DR
R772 VDD N426 100k
J_F210 VDD N426 P467 DR
R773 P467 n98 1k
R774 n98 VSS 4.8k
J_B226 N426 n97 0 DR
R775 VDD N427 100k
J_F211 VDD N427 P468 DR
R776 P468 n99 1k
R777 n99 VSS 4.8k
J_B227 N427 LOAD P469 DR
J_A338 P469 n98 0 DR
R778 VDD N428 100k
J_F212 VDD N428 P470 DR
R779 P470 LH 1k
R780 LH VSS 4.8k
J_B228 N428 n99 0 DR
R781 VDD N429 100k
J_F213 VDD N429 P471 DR
R782 P471 n101 1k
R783 n101 VSS 4.8k
J_B229 N429 2Lower2 P472 DR
J_A339 P472 2Upper0 0 DR
R784 VDD N430 100k
J_F214 VDD N430 P473 DR
R785 P473 n102 1k
R786 n102 VSS 4.8k
J_B230 N430 n101 0 DR
R787 VDD N431 100k
J_F215 VDD N431 P474 DR
R788 P474 n103 1k
R789 n103 VSS 4.8k
J_B231 N431 LOAD P475 DR
J_A340 P475 n102 0 DR
R790 VDD N432 100k
J_F216 VDD N432 P476 DR
R791 P476 LW 1k
R792 LW VSS 4.8k
J_B232 N432 n103 0 DR
R793 VDD N433 100k
J_F217 VDD N433 P477 DR
R794 P477 n105 1k
R795 n105 VSS 4.8k
J_B233 N433 2Lower0 P478 DR
J_A341 P478 2Upper1 0 DR
R796 VDD N434 100k
J_F218 VDD N434 P479 DR
R797 P479 n106 1k
R798 n106 VSS 4.8k
J_B234 N434 n105 0 DR
R799 VDD N435 100k
J_F219 VDD N435 P480 DR
R800 P480 n107 1k
R801 n107 VSS 4.8k
J_B235 N435 LOAD P481 DR
J_A342 P481 n106 0 DR
R802 VDD N436 100k
J_F220 VDD N436 P482 DR
R803 P482 LBU 1k
R804 LBU VSS 4.8k
J_B236 N436 n107 0 DR
R805 VDD N437 100k
J_F221 VDD N437 P483 DR
R806 P483 n109 1k
R807 n109 VSS 4.8k
J_B237 N437 2Lower1 P484 DR
J_A343 P484 2Upper1 0 DR
R808 VDD N438 100k
J_F222 VDD N438 P485 DR
R809 P485 n110 1k
R810 n110 VSS 4.8k
J_B238 N438 n109 0 DR
R811 VDD N439 100k
J_F223 VDD N439 P486 DR
R812 P486 n111 1k
R813 n111 VSS 4.8k
J_B239 N439 LOAD P487 DR
J_A344 P487 n110 0 DR
R814 VDD N440 100k
J_F224 VDD N440 P488 DR
R815 P488 LHU 1k
R816 LHU VSS 4.8k
J_B240 N440 n111 0 DR
R817 VDD N441 100k
J_F225 VDD N441 P489 DR
R818 P489 n113 1k
R819 n113 VSS 4.8k
J_B241 N441 2Lower0 P490 DR
J_A345 P490 2Upper0 0 DR
R820 VDD N442 100k
J_F226 VDD N442 P491 DR
R821 P491 n114 1k
R822 n114 VSS 4.8k
J_B242 N442 n113 0 DR
R823 VDD N443 100k
J_F227 VDD N443 P492 DR
R824 P492 n115 1k
R825 n115 VSS 4.8k
J_B243 N443 STORE P493 DR
J_A346 P493 n114 0 DR
R826 VDD N444 100k
J_F228 VDD N444 P494 DR
R827 P494 SB 1k
R828 SB VSS 4.8k
J_B244 N444 n115 0 DR
R829 VDD N445 100k
J_F229 VDD N445 P495 DR
R830 P495 n117 1k
R831 n117 VSS 4.8k
J_B245 N445 2Lower1 P496 DR
J_A347 P496 2Upper0 0 DR
R832 VDD N446 100k
J_F230 VDD N446 P497 DR
R833 P497 n118 1k
R834 n118 VSS 4.8k
J_B246 N446 n117 0 DR
R835 VDD N447 100k
J_F231 VDD N447 P498 DR
R836 P498 n119 1k
R837 n119 VSS 4.8k
J_B247 N447 STORE P499 DR
J_A348 P499 n118 0 DR
R838 VDD N448 100k
J_F232 VDD N448 P500 DR
R839 P500 SH 1k
R840 SH VSS 4.8k
J_B248 N448 n119 0 DR
R841 VDD N449 100k
J_F233 VDD N449 P501 DR
R842 P501 n121 1k
R843 n121 VSS 4.8k
J_B249 N449 2Lower2 P502 DR
J_A349 P502 2Upper0 0 DR
R844 VDD N450 100k
J_F234 VDD N450 P503 DR
R845 P503 n122 1k
R846 n122 VSS 4.8k
J_B250 N450 n121 0 DR
R847 VDD N451 100k
J_F235 VDD N451 P504 DR
R848 P504 n123 1k
R849 n123 VSS 4.8k
J_B251 N451 STORE P505 DR
J_A350 P505 n122 0 DR
R850 VDD N452 100k
J_F236 VDD N452 P506 DR
R851 P506 SW 1k
R852 SW VSS 4.8k
J_B252 N452 n123 0 DR
R853 VDD N453 100k
J_F237 VDD N453 P507 DR
R854 P507 n125 1k
R855 n125 VSS 4.8k
J_B253 N453 2Lower0 P508 DR
J_A351 P508 2Upper0 0 DR
R856 VDD N454 100k
J_F238 VDD N454 P509 DR
R857 P509 n126 1k
R858 n126 VSS 4.8k
J_B254 N454 n125 0 DR
R859 VDD N455 100k
J_F239 VDD N455 P510 DR
R860 P510 n127 1k
R861 n127 VSS 4.8k
J_B255 N455 OP_IMM P511 DR
J_A352 P511 n126 0 DR
R862 VDD N456 100k
J_F240 VDD N456 P512 DR
R863 P512 ADDI 1k
R864 ADDI VSS 4.8k
J_B256 N456 n127 0 DR
R865 VDD N457 100k
J_F241 VDD N457 P513 DR
R866 P513 n129 1k
R867 n129 VSS 4.8k
J_B257 N457 2Lower2 P514 DR
J_A353 P514 2Upper0 0 DR
R868 VDD N458 100k
J_F242 VDD N458 P515 DR
R869 P515 n130 1k
R870 n130 VSS 4.8k
J_B258 N458 n129 0 DR
R871 VDD N459 100k
J_F243 VDD N459 P516 DR
R872 P516 n131 1k
R873 n131 VSS 4.8k
J_B259 N459 OP_IMM P517 DR
J_A354 P517 n130 0 DR
R874 VDD N460 100k
J_F244 VDD N460 P518 DR
R875 P518 SLTI 1k
R876 SLTI VSS 4.8k
J_B260 N460 n131 0 DR
R877 VDD N461 100k
J_F245 VDD N461 P519 DR
R878 P519 n133 1k
R879 n133 VSS 4.8k
J_B261 N461 2Lower3 P520 DR
J_A355 P520 2Upper0 0 DR
R880 VDD N462 100k
J_F246 VDD N462 P521 DR
R881 P521 n134 1k
R882 n134 VSS 4.8k
J_B262 N462 n133 0 DR
R883 VDD N463 100k
J_F247 VDD N463 P522 DR
R884 P522 n135 1k
R885 n135 VSS 4.8k
J_B263 N463 OP_IMM P523 DR
J_A356 P523 n134 0 DR
R886 VDD N464 100k
J_F248 VDD N464 P524 DR
R887 P524 SLTIU 1k
R888 SLTIU VSS 4.8k
J_B264 N464 n135 0 DR
R889 VDD N465 100k
J_F249 VDD N465 P525 DR
R890 P525 n137 1k
R891 n137 VSS 4.8k
J_B265 N465 2Lower0 P526 DR
J_A357 P526 2Upper1 0 DR
R892 VDD N466 100k
J_F250 VDD N466 P527 DR
R893 P527 n138 1k
R894 n138 VSS 4.8k
J_B266 N466 n137 0 DR
R895 VDD N467 100k
J_F251 VDD N467 P528 DR
R896 P528 n139 1k
R897 n139 VSS 4.8k
J_B267 N467 OP_IMM P529 DR
J_A358 P529 n138 0 DR
R898 VDD N468 100k
J_F252 VDD N468 P530 DR
R899 P530 XORI 1k
R900 XORI VSS 4.8k
J_B268 N468 n139 0 DR
R901 VDD N469 100k
J_F253 VDD N469 P531 DR
R902 P531 n141 1k
R903 n141 VSS 4.8k
J_B269 N469 2Lower2 P532 DR
J_A359 P532 2Upper1 0 DR
R904 VDD N470 100k
J_F254 VDD N470 P533 DR
R905 P533 n142 1k
R906 n142 VSS 4.8k
J_B270 N470 n141 0 DR
R907 VDD N471 100k
J_F255 VDD N471 P534 DR
R908 P534 n143 1k
R909 n143 VSS 4.8k
J_B271 N471 OP_IMM P535 DR
J_A360 P535 n142 0 DR
R910 VDD N472 100k
J_F256 VDD N472 P536 DR
R911 P536 ORI 1k
R912 ORI VSS 4.8k
J_B272 N472 n143 0 DR
R913 VDD N473 100k
J_F257 VDD N473 P537 DR
R914 P537 n145 1k
R915 n145 VSS 4.8k
J_B273 N473 2Lower3 P538 DR
J_A361 P538 2Upper1 0 DR
R916 VDD N474 100k
J_F258 VDD N474 P539 DR
R917 P539 n146 1k
R918 n146 VSS 4.8k
J_B274 N474 n145 0 DR
R919 VDD N475 100k
J_F259 VDD N475 P540 DR
R920 P540 n147 1k
R921 n147 VSS 4.8k
J_B275 N475 OP_IMM P541 DR
J_A362 P541 n146 0 DR
R922 VDD N476 100k
J_F260 VDD N476 P542 DR
R923 P542 ANDI 1k
R924 ANDI VSS 4.8k
J_B276 N476 n147 0 DR
R925 VDD N477 100k
J_F261 VDD N477 P543 DR
R926 P543 n149 1k
R927 n149 VSS 4.8k
J_B277 N477 2Lower1 P544 DR
J_A363 P544 2Upper0 0 DR
R928 VDD N478 100k
J_F262 VDD N478 P545 DR
R929 P545 n150 1k
R930 n150 VSS 4.8k
J_B278 N478 n149 0 DR
R931 VDD N479 100k
J_F263 VDD N479 P546 DR
R932 P546 n151 1k
R933 n151 VSS 4.8k
J_B279 N479 OP_IMM P547 DR
J_A364 P547 n150 0 DR
R934 VDD N480 100k
J_F264 VDD N480 P548 DR
R935 P548 SLLI 1k
R936 SLLI VSS 4.8k
J_B280 N480 n151 0 DR
R937 VDD N481 100k
J_F265 VDD N481 P549 DR
R938 P549 n153 1k
R939 n153 VSS 4.8k
J_B281 N481 2Lower1 P550 DR
J_A365 P550 2Upper1 0 DR
R940 VDD N482 100k
J_F266 VDD N482 P551 DR
R941 P551 n154 1k
R942 n154 VSS 4.8k
J_B282 N482 n153 0 DR
R943 VDD N483 100k
J_F267 VDD N483 P552 DR
R944 P552 n155 1k
R945 n155 VSS 4.8k
J_B283 N483 OP_IMM P553 DR
J_A366 P553 n154 0 DR
R946 VDD N484 100k
J_F268 VDD N484 P554 DR
R947 P554 SRLI_SRAI 1k
R948 SRLI_SRAI VSS 4.8k
J_B284 N484 n155 0 DR
R949 VDD N485 100k
J_F269 VDD N485 P555 DR
R950 P555 n157 1k
R951 n157 VSS 4.8k
J_B285 N485 2Lower0 P556 DR
J_A367 P556 2Upper0 0 DR
R952 VDD N486 100k
J_F270 VDD N486 P557 DR
R953 P557 n158 1k
R954 n158 VSS 4.8k
J_B286 N486 n157 0 DR
R955 VDD N487 100k
J_F271 VDD N487 P558 DR
R956 P558 n159 1k
R957 n159 VSS 4.8k
J_B287 N487 OP P559 DR
J_A368 P559 n158 0 DR
R958 VDD N488 100k
J_F272 VDD N488 P560 DR
R959 P560 ADD_SUB 1k
R960 ADD_SUB VSS 4.8k
J_B288 N488 n159 0 DR
R961 VDD N489 100k
J_F273 VDD N489 P561 DR
R962 P561 n161 1k
R963 n161 VSS 4.8k
J_B289 N489 2Lower1 P562 DR
J_A369 P562 2Upper0 0 DR
R964 VDD N490 100k
J_F274 VDD N490 P563 DR
R965 P563 n162 1k
R966 n162 VSS 4.8k
J_B290 N490 n161 0 DR
R967 VDD N491 100k
J_F275 VDD N491 P564 DR
R968 P564 n163 1k
R969 n163 VSS 4.8k
J_B291 N491 OP P565 DR
J_A370 P565 n162 0 DR
R970 VDD N492 100k
J_F276 VDD N492 P566 DR
R971 P566 SLL 1k
R972 SLL VSS 4.8k
J_B292 N492 n163 0 DR
R973 VDD N493 100k
J_F277 VDD N493 P567 DR
R974 P567 n165 1k
R975 n165 VSS 4.8k
J_B293 N493 2Lower2 P568 DR
J_A371 P568 2Upper0 0 DR
R976 VDD N494 100k
J_F278 VDD N494 P569 DR
R977 P569 n166 1k
R978 n166 VSS 4.8k
J_B294 N494 n165 0 DR
R979 VDD N495 100k
J_F279 VDD N495 P570 DR
R980 P570 n167 1k
R981 n167 VSS 4.8k
J_B295 N495 OP P571 DR
J_A372 P571 n166 0 DR
R982 VDD N496 100k
J_F280 VDD N496 P572 DR
R983 P572 SLT 1k
R984 SLT VSS 4.8k
J_B296 N496 n167 0 DR
R985 VDD N497 100k
J_F281 VDD N497 P573 DR
R986 P573 n169 1k
R987 n169 VSS 4.8k
J_B297 N497 2Lower3 P574 DR
J_A373 P574 2Upper0 0 DR
R988 VDD N498 100k
J_F282 VDD N498 P575 DR
R989 P575 n170 1k
R990 n170 VSS 4.8k
J_B298 N498 n169 0 DR
R991 VDD N499 100k
J_F283 VDD N499 P576 DR
R992 P576 n171 1k
R993 n171 VSS 4.8k
J_B299 N499 OP P577 DR
J_A374 P577 n170 0 DR
R994 VDD N500 100k
J_F284 VDD N500 P578 DR
R995 P578 SLTU 1k
R996 SLTU VSS 4.8k
J_B300 N500 n171 0 DR
R997 VDD N501 100k
J_F285 VDD N501 P579 DR
R998 P579 n173 1k
R999 n173 VSS 4.8k
J_B301 N501 2Lower0 P580 DR
J_A375 P580 2Upper1 0 DR
R1000 VDD N502 100k
J_F286 VDD N502 P581 DR
R1001 P581 n174 1k
R1002 n174 VSS 4.8k
J_B302 N502 n173 0 DR
R1003 VDD N503 100k
J_F287 VDD N503 P582 DR
R1004 P582 n175 1k
R1005 n175 VSS 4.8k
J_B303 N503 OP P583 DR
J_A376 P583 n174 0 DR
R1006 VDD N504 100k
J_F288 VDD N504 P584 DR
R1007 P584 XOR 1k
R1008 XOR VSS 4.8k
J_B304 N504 n175 0 DR
R1009 VDD N505 100k
J_F289 VDD N505 P585 DR
R1010 P585 n177 1k
R1011 n177 VSS 4.8k
J_B305 N505 2Lower1 P586 DR
J_A377 P586 2Upper1 0 DR
R1012 VDD N506 100k
J_F290 VDD N506 P587 DR
R1013 P587 n178 1k
R1014 n178 VSS 4.8k
J_B306 N506 n177 0 DR
R1015 VDD N507 100k
J_F291 VDD N507 P588 DR
R1016 P588 n179 1k
R1017 n179 VSS 4.8k
J_B307 N507 OP P589 DR
J_A378 P589 n178 0 DR
R1018 VDD N508 100k
J_F292 VDD N508 P590 DR
R1019 P590 SRL_SRA 1k
R1020 SRL_SRA VSS 4.8k
J_B308 N508 n179 0 DR
R1021 VDD N509 100k
J_F293 VDD N509 P591 DR
R1022 P591 n181 1k
R1023 n181 VSS 4.8k
J_B309 N509 2Lower2 P592 DR
J_A379 P592 2Upper1 0 DR
R1024 VDD N510 100k
J_F294 VDD N510 P593 DR
R1025 P593 n182 1k
R1026 n182 VSS 4.8k
J_B310 N510 n181 0 DR
R1027 VDD N511 100k
J_F295 VDD N511 P594 DR
R1028 P594 n183 1k
R1029 n183 VSS 4.8k
J_B311 N511 OP P595 DR
J_A380 P595 n182 0 DR
R1030 VDD N512 100k
J_F296 VDD N512 P596 DR
R1031 P596 OR 1k
R1032 OR VSS 4.8k
J_B312 N512 n183 0 DR
R1033 VDD N513 100k
J_F297 VDD N513 P597 DR
R1034 P597 n185 1k
R1035 n185 VSS 4.8k
J_B313 N513 2Lower3 P598 DR
J_A381 P598 2Upper1 0 DR
R1036 VDD N514 100k
J_F298 VDD N514 P599 DR
R1037 P599 n186 1k
R1038 n186 VSS 4.8k
J_B314 N514 n185 0 DR
R1039 VDD N515 100k
J_F299 VDD N515 P600 DR
R1040 P600 n187 1k
R1041 n187 VSS 4.8k
J_B315 N515 OP P601 DR
J_A382 P601 n186 0 DR
R1042 VDD N516 100k
J_F300 VDD N516 P602 DR
R1043 P602 AND 1k
R1044 AND VSS 4.8k
J_B316 N516 n187 0 DR
R1045 VDD N517 100k
J_F301 VDD N517 P603 DR
R1046 P603 n189 1k
R1047 n189 VSS 4.8k
J_B317 N517 SLTI 0 DR
J_B318 N517 ADDI 0 DR
R1048 VDD N518 100k
J_F302 VDD N518 P604 DR
R1049 P604 n190 1k
R1050 n190 VSS 4.8k
J_B319 N518 n189 0 DR
R1051 VDD N519 100k
J_F303 VDD N519 P605 DR
R1052 P605 n191 1k
R1053 n191 VSS 4.8k
J_B320 N519 XORI 0 DR
J_B321 N519 SLTIU 0 DR
R1054 VDD N520 100k
J_F304 VDD N520 P606 DR
R1055 P606 n192 1k
R1056 n192 VSS 4.8k
J_B322 N520 n191 0 DR
R1057 VDD N521 100k
J_F305 VDD N521 P607 DR
R1058 P607 n193 1k
R1059 n193 VSS 4.8k
J_B323 N521 n192 0 DR
J_B324 N521 n190 0 DR
R1060 VDD N522 100k
J_F306 VDD N522 P608 DR
R1061 P608 n194 1k
R1062 n194 VSS 4.8k
J_B325 N522 n193 0 DR
R1063 VDD N523 100k
J_F307 VDD N523 P609 DR
R1064 P609 n195 1k
R1065 n195 VSS 4.8k
J_B326 N523 ANDI 0 DR
J_B327 N523 ORI 0 DR
R1066 VDD N524 100k
J_F308 VDD N524 P610 DR
R1067 P610 n196 1k
R1068 n196 VSS 4.8k
J_B328 N524 n195 0 DR
R1069 VDD N525 100k
J_F309 VDD N525 P611 DR
R1070 P611 n197 1k
R1071 n197 VSS 4.8k
J_B329 N525 SRLI_SRAI 0 DR
J_B330 N525 SLLI 0 DR
R1072 VDD N526 100k
J_F310 VDD N526 P612 DR
R1073 P612 n198 1k
R1074 n198 VSS 4.8k
J_B331 N526 n197 0 DR
R1075 VDD N527 100k
J_F311 VDD N527 P613 DR
R1076 P613 n199 1k
R1077 n199 VSS 4.8k
J_B332 N527 n198 0 DR
J_B333 N527 n196 0 DR
R1078 VDD N528 100k
J_F312 VDD N528 P614 DR
R1079 P614 n200 1k
R1080 n200 VSS 4.8k
J_B334 N528 n199 0 DR
R1081 VDD N529 100k
J_F313 VDD N529 P615 DR
R1082 P615 n201 1k
R1083 n201 VSS 4.8k
J_B335 N529 n200 0 DR
J_B336 N529 n194 0 DR
R1084 VDD N530 100k
J_F314 VDD N530 P616 DR
R1085 P616 ALU_IMM 1k
R1086 ALU_IMM VSS 4.8k
J_B337 N530 n201 0 DR
R1087 VDD N531 100k
J_F315 VDD N531 P617 DR
R1088 P617 n203 1k
R1089 n203 VSS 4.8k
J_B338 N531 SLL 0 DR
J_B339 N531 ADD_SUB 0 DR
R1090 VDD N532 100k
J_F316 VDD N532 P618 DR
R1091 P618 n204 1k
R1092 n204 VSS 4.8k
J_B340 N532 n203 0 DR
R1093 VDD N533 100k
J_F317 VDD N533 P619 DR
R1094 P619 n205 1k
R1095 n205 VSS 4.8k
J_B341 N533 SLTU 0 DR
J_B342 N533 SLT 0 DR
R1096 VDD N534 100k
J_F318 VDD N534 P620 DR
R1097 P620 n206 1k
R1098 n206 VSS 4.8k
J_B343 N534 n205 0 DR
R1099 VDD N535 100k
J_F319 VDD N535 P621 DR
R1100 P621 n207 1k
R1101 n207 VSS 4.8k
J_B344 N535 n206 0 DR
J_B345 N535 n204 0 DR
R1102 VDD N536 100k
J_F320 VDD N536 P622 DR
R1103 P622 n208 1k
R1104 n208 VSS 4.8k
J_B346 N536 n207 0 DR
R1105 VDD N537 100k
J_F321 VDD N537 P623 DR
R1106 P623 n209 1k
R1107 n209 VSS 4.8k
J_B347 N537 SRL_SRA 0 DR
J_B348 N537 XOR 0 DR
R1108 VDD N538 100k
J_F322 VDD N538 P624 DR
R1109 P624 n210 1k
R1110 n210 VSS 4.8k
J_B349 N538 n209 0 DR
R1111 VDD N539 100k
J_F323 VDD N539 P625 DR
R1112 P625 n211 1k
R1113 n211 VSS 4.8k
J_B350 N539 AND 0 DR
J_B351 N539 OR 0 DR
R1114 VDD N540 100k
J_F324 VDD N540 P626 DR
R1115 P626 n212 1k
R1116 n212 VSS 4.8k
J_B352 N540 n211 0 DR
R1117 VDD N541 100k
J_F325 VDD N541 P627 DR
R1118 P627 n213 1k
R1119 n213 VSS 4.8k
J_B353 N541 n212 0 DR
J_B354 N541 n210 0 DR
R1120 VDD N542 100k
J_F326 VDD N542 P628 DR
R1121 P628 n214 1k
R1122 n214 VSS 4.8k